# EAGLE design General IO (EAGLE 4.13)
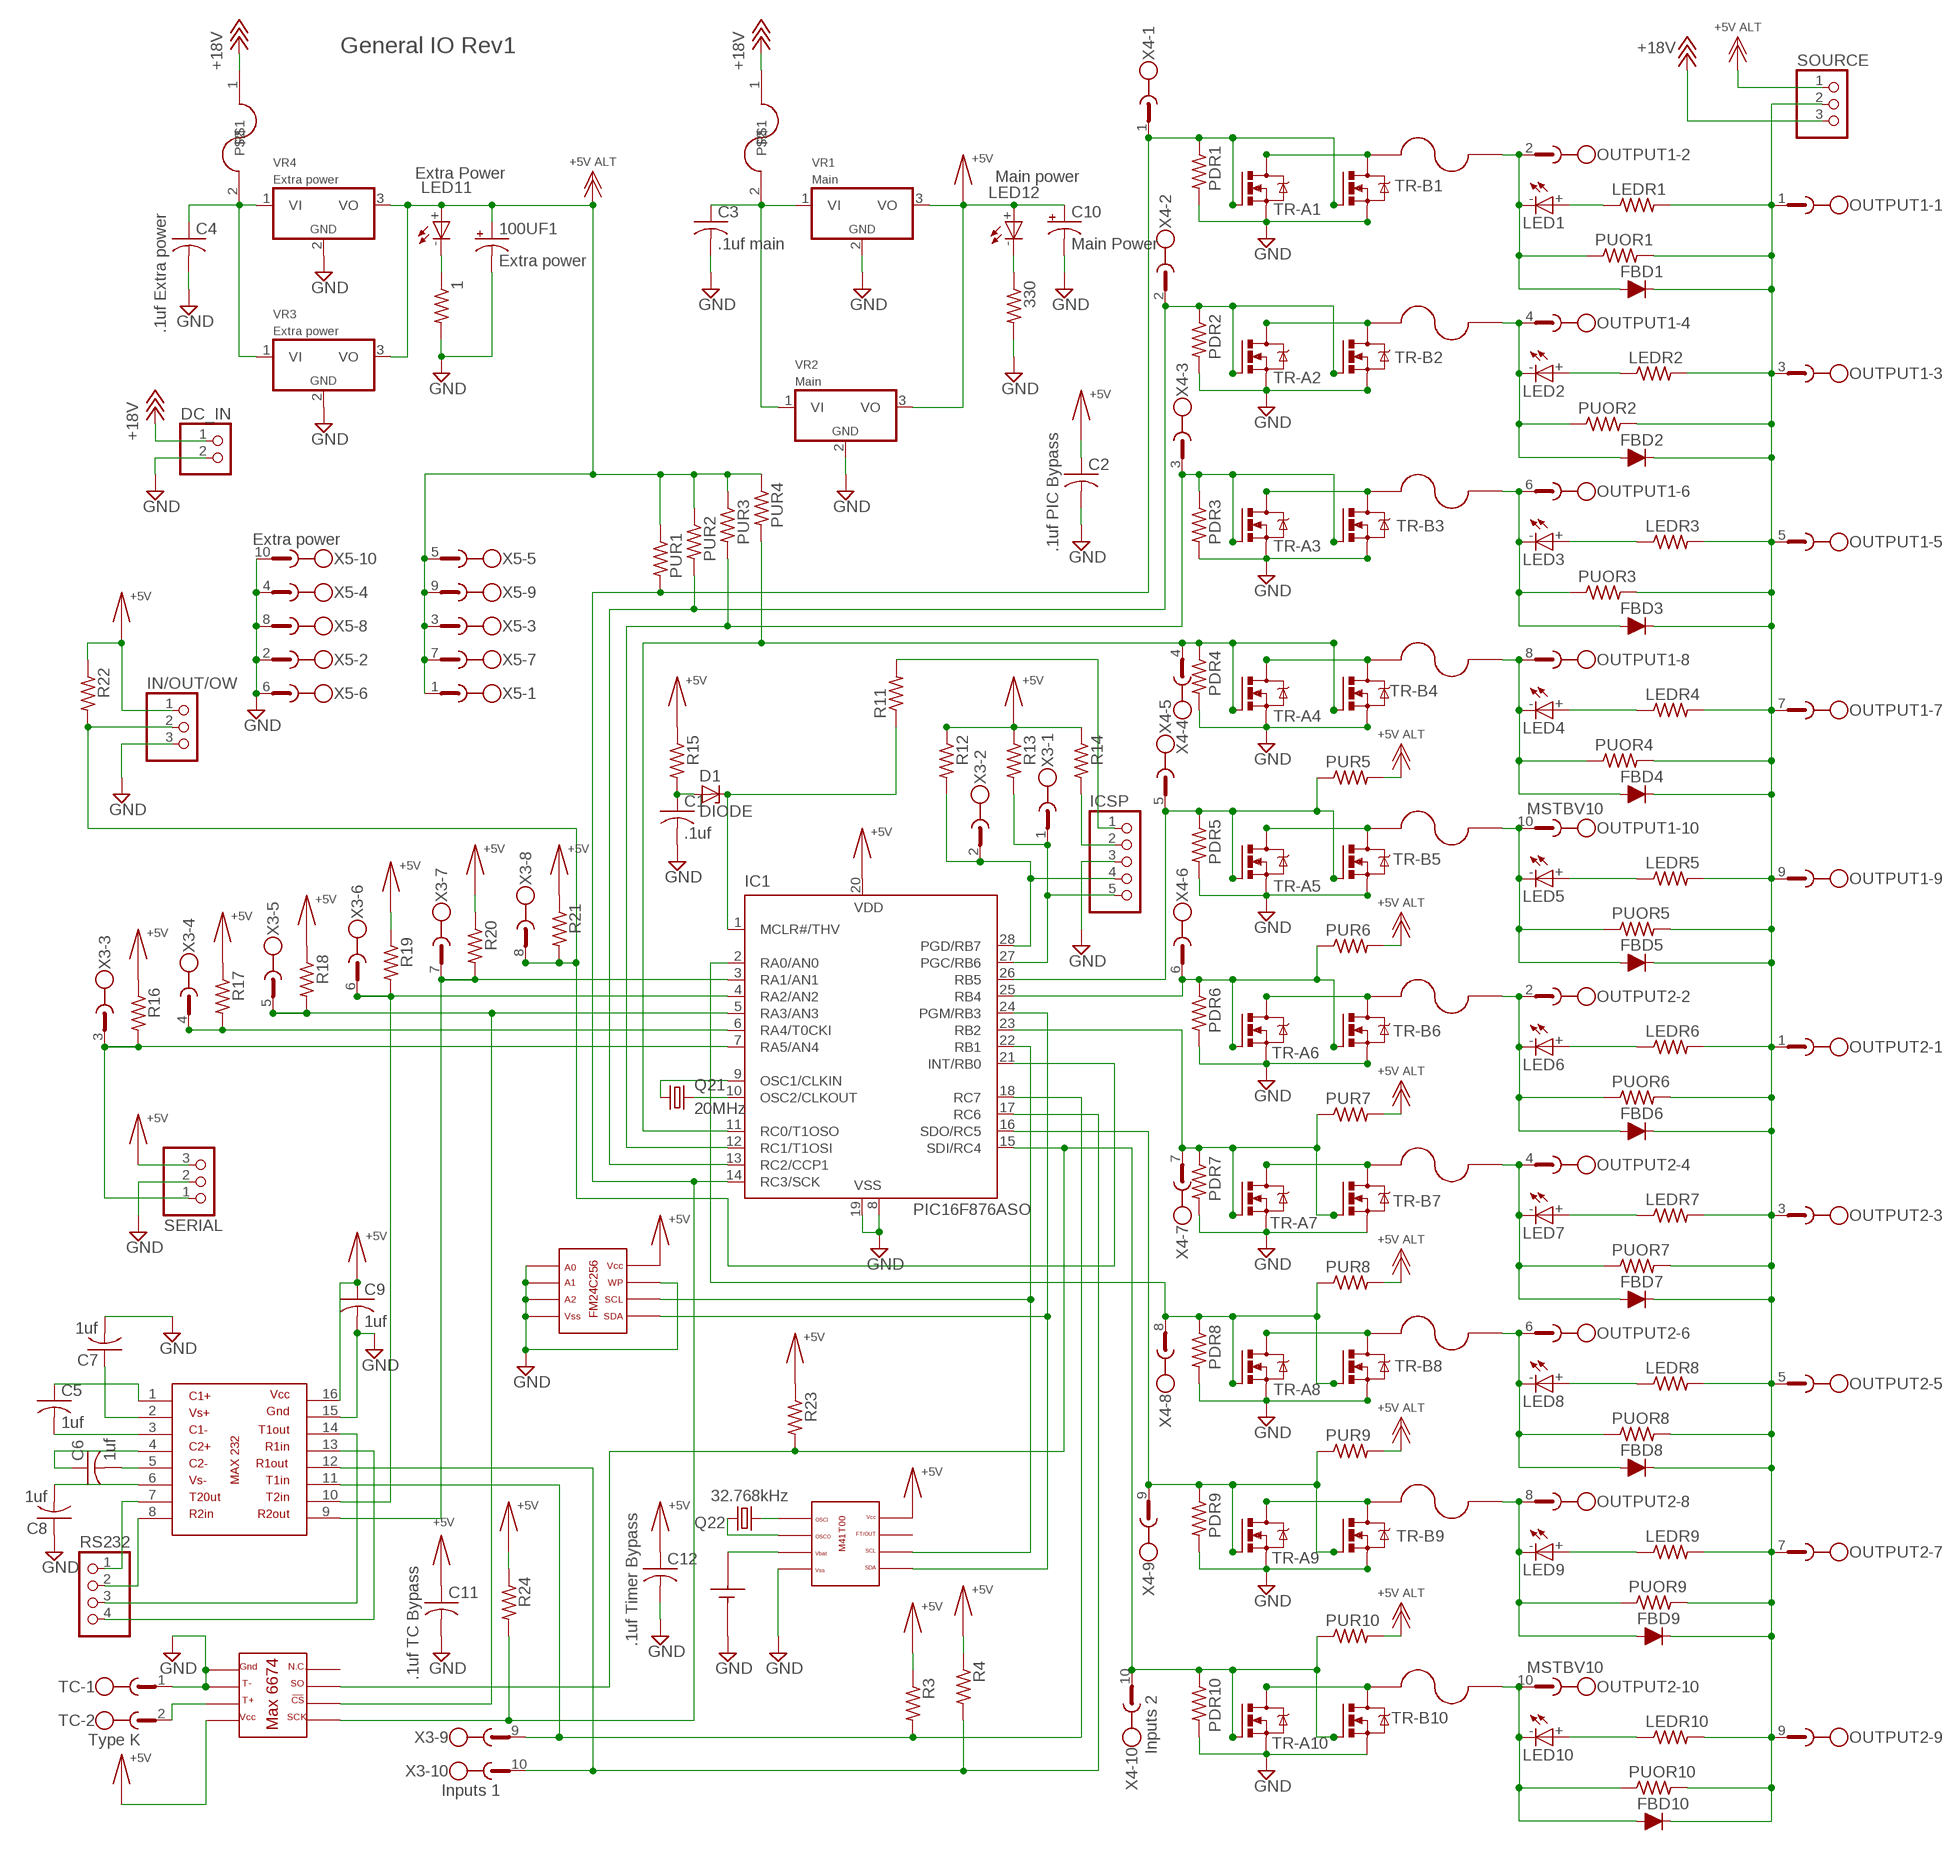
[diagram p0: schematic, sheet 1]

## Parts
1  RESISITORR1210  [R1210]
100UF1  Extra power  CAPACITOR-ELECTROLYTICG  [PANASONIC_G]
330  RESISITORR1210  [R1210]
BAT1  BH-401  [BH-401]
C1  .1uf  CAPACITOR-NO-POLARITYC1210  [C1210]
C2  .1uf PIC Bypass  CAPACITOR-NO-POLARITYC1210  [C1210]
C3  .1uf main  CAPACITOR-NO-POLARITYC1210  [C1210]
C4  .1uf Extra power  CAPACITOR-NO-POLARITYC1210  [C1210]
C5  1uf  CAPACITOR-NO-POLARITYC1210  [C1210]
C6  1uf  CAPACITOR-NO-POLARITYC1210  [C1210]
C7  1uf  CAPACITOR-NO-POLARITYC1210  [C1210]
C8  1uf  CAPACITOR-NO-POLARITYC1210  [C1210]
C9  1uf  CAPACITOR-NO-POLARITYC1210  [C1210]
C10  Main Power  CAPACITOR-ELECTROLYTICG  [PANASONIC_G]
C11  .1uf TC Bypass  CAPACITOR-NO-POLARITYC1210  [C1210]
C12  .1uf Timer Bypass  CAPACITOR-NO-POLARITYC1210  [C1210]
D1  DIODE  DIODE-SWITCHING  [SOT323-W]
DC_IN  PINHD-1X2  [1X02]
FBD1  D-FILL-SOD-87  [SOD87]
FBD2  D-FILL-SOD-87  [SOD87]
FBD3  D-FILL-SOD-87  [SOD87]
FBD4  D-FILL-SOD-87  [SOD87]
FBD5  D-FILL-SOD-87  [SOD87]
FBD6  D-FILL-SOD-87  [SOD87]
FBD7  D-FILL-SOD-87  [SOD87]
FBD8  D-FILL-SOD-87  [SOD87]
FBD9  D-FILL-SOD-87  [SOD87]
FBD10  D-FILL-SOD-87  [SOD87]
FUSE1  FUSE(SM)  [FUSE]
FUSE2  FUSE(SM)  [FUSE]
FUSE3  FUSE(SM)  [FUSE]
FUSE4  FUSE(SM)  [FUSE]
FUSE5  FUSE(SM)  [FUSE]
FUSE6  FUSE(SM)  [FUSE]
FUSE7  FUSE(SM)  [FUSE]
FUSE8  FUSE(SM)  [FUSE]
FUSE9  FUSE(SM)  [FUSE]
FUSE10  FUSE(SM)  [FUSE]
IC1  PIC16F876ASO  PIC16F876SO  [SO-28W]
ICSP  PINHD-1X5  [1X05]
IN/OUT/OW  PINHD-1X3  [1X03]
LED1  LED  [1206]
LED2  LED  [1206]
LED3  LED  [1206]
LED4  LED  [1206]
LED5  LED  [1206]
LED6  LED  [1206]
LED7  LED  [1206]
LED8  LED  [1206]
LED9  LED  [1206]
LED10  LED  [1206]
LED11  Extra Power  LED  [1206]
LED12  Main power  LED  [1206]
LEDR1  RESISITORM1406  [M1406]
LEDR2  RESISITORM1406  [M1406]
LEDR3  RESISITORM1406  [M1406]
LEDR4  RESISITORM1406  [M1406]
LEDR5  RESISITORM1406  [M1406]
LEDR6  RESISITORM1406  [M1406]
LEDR7  RESISITORM1406  [M1406]
LEDR8  RESISITORM1406  [M1406]
LEDR9  RESISITORM1406  [M1406]
LEDR10  RESISITORM1406  [M1406]
OUTPUT1  MSTBV10  [MSTBV10]
OUTPUT2  MSTBV10  [MSTBV10]
PDR1  RESISITORM1406  [M1406]
PDR2  RESISITORM1406  [M1406]
PDR3  RESISITORM1406  [M1406]
PDR4  RESISITORM1406  [M1406]
PDR5  RESISITORM1406  [M1406]
PDR6  RESISITORM1406  [M1406]
PDR7  RESISITORM1406  [M1406]
PDR8  RESISITORM1406  [M1406]
PDR9  RESISITORM1406  [M1406]
PDR10  RESISITORM1406  [M1406]
POLYFUSE1  Extra Power  POLYFUSE  [0204/5]
POLYFUSE2  Main power  POLYFUSE  [0204/5]
PUOR1  RESISITORM1406  [M1406]
PUOR2  RESISITORM1406  [M1406]
PUOR3  RESISITORM1406  [M1406]
PUOR4  RESISITORM1406  [M1406]
PUOR5  RESISITORM1406  [M1406]
PUOR6  RESISITORM1406  [M1406]
PUOR7  RESISITORM1406  [M1406]
PUOR8  RESISITORM1406  [M1406]
PUOR9  RESISITORM1406  [M1406]
PUOR10  RESISITORM1406  [M1406]
PUR1  RESISITORM1406  [M1406]
PUR2  RESISITORM1406  [M1406]
PUR3  RESISITORM1406  [M1406]
PUR4  RESISITORM1406  [M1406]
PUR5  RESISITORM1406  [M1406]
PUR6  RESISITORM1406  [M1406]
PUR7  RESISITORM1406  [M1406]
PUR8  RESISITORM1406  [M1406]
PUR9  RESISITORM1406  [M1406]
PUR10  RESISITORM1406  [M1406]
Q21  20MHz  CRYSTALSM49  [SM49]
Q22  32.768kHz  CRYSTALTC26H  [TC26H]
R3  RESISITORM1406  [M1406]
R4  RESISITORM1406  [M1406]
R11  RESISITORR1210  [R1210]
R12  RESISITORM1406  [M1406]
R13  RESISITORM1406  [M1406]
R14  RESISITORM1406  [M1406]
R15  RESISITORR1210  [R1210]
R16  RESISITORM1406  [M1406]
R17  RESISITORM1406  [M1406]
R18  RESISITORM1406  [M1406]
R19  RESISITORM1406  [M1406]
R20  RESISITORM1406  [M1406]
R21  RESISITORM1406  [M1406]
R22  RESISITORR1210  [R1210]
R23  RESISITORM1406  [M1406]
R24  RESISITORM1406  [M1406]
RS232  PINHD-1X4  [1X04]
SERIAL  PINHD-1X3  [1X03]
SOURCE  PINHD-1X3  [1X03]
TC  Type K  MST2V  [MSTBV2]
TR-A1  ZXMN10A08GSOT223  [SOT223R_INFINEON]
TR-A2  ZXMN10A08GSOT223  [SOT223R_INFINEON]
TR-A3  ZXMN10A08GSOT223  [SOT223R_INFINEON]
TR-A4  ZXMN10A08GSOT223  [SOT223R_INFINEON]
TR-A5  ZXMN10A08GSOT223  [SOT223R_INFINEON]
TR-A6  ZXMN10A08GSOT223  [SOT223R_INFINEON]
TR-A7  ZXMN10A08GSOT223  [SOT223R_INFINEON]
TR-A8  ZXMN10A08GSOT223  [SOT223R_INFINEON]
TR-A9  ZXMN10A08GSOT223  [SOT223R_INFINEON]
TR-A10  ZXMN10A08GSOT223  [SOT223R_INFINEON]
TR-B1  ZXMN10A08G  [TO220BV]
TR-B2  ZXMN10A08G  [TO220BV]
TR-B3  ZXMN10A08G  [TO220BV]
TR-B4  ZXMN10A08G  [TO220BV]
TR-B5  ZXMN10A08G  [TO220BV]
TR-B6  ZXMN10A08G  [TO220BV]
TR-B7  ZXMN10A08G  [TO220BV]
TR-B8  ZXMN10A08G  [TO220BV]
TR-B9  ZXMN10A08G  [TO220BV]
TR-B10  ZXMN10A08G  [TO220BV]
U$1  MAX232  [SO16]
U$2  MAX6674  [SO08]
U$4  M41T00TIMER-I2C  [SO08]
U$18  FM24C256  [SO08]
VR1  Main  VOLTAGE-REGULATOR  [TO220S]
VR2  Main  VOLTAGE-REGULATORSO-223  [SOT223R_INFINEON]
VR3  Extra power  VOLTAGE-REGULATORSO-223  [SOT223R_INFINEON]
VR4  Extra power  VOLTAGE-REGULATOR  [TO220S]
X3  Inputs 1  MSTBV10  [MSTBV10]
X4  Inputs 2  MSTBV10  [MSTBV10]
X5  Extra power  MSTBV10  [MSTBV10]

## Nets
$N199: IC1.15(SDI/RC4) PDR10.1 PUR10.1 R23.2 TR-A10.1(G) TR-B10.G U$2.7 X4.10
+5V: C2.1 C9.1 C10.+ C11.1 C12.1 IC1.20(VDD) IN/OUT/OW.1 LED12.+ R3.1 R4.1 R12.1 R13.1 R14.1 R15.1 R16.1 R17.1 R18.1 R19.1 R20.1 R21.1 R22.1 R23.1 R24.1 SERIAL.3 U$1.16 U$2.4 U$4.8(VCC) U$18.8(VDD) VR1.3(VO) VR2.3(VO)
+18V: DC_IN.1 POLYFUSE1.1 POLYFUSE2.1 SOURCE.3
ALT5V: 100UF1.+ LED11.+ PUR1.1 PUR2.1 PUR3.1 PUR4.1 PUR5.2 PUR6.2 PUR7.2 PUR8.2 PUR9.2 PUR10.2 SOURCE.1 VR3.3(VO) VR4.3(VO) X5.1 X5.3 X5.5 X5.7 X5.9
GND: 1.2 100UF1.- 330.2 BAT1.P$2 C1.2 C2.2 C3.2 C4.2 C7.2 C8.1 C9.2 C10.- C11.2 C12.2 DC_IN.2 IC1.8(VSS) IC1.19(VSS) ICSP.3 IN/OUT/OW.3 PDR1.2 PDR2.2 PDR3.2 PDR4.2 PDR5.2 PDR6.2 PDR7.2 PDR8.2 PDR9.2 PDR10.2 SERIAL.2 TC.1 TR-A1.3(S) TR-A2.3(S) TR-A3.3(S) TR-A4.3(S) TR-A5.3(S) TR-A6.3(S) TR-A7.3(S) TR-A8.3(S) TR-A9.3(S) TR-A10.3(S) TR-B1.S TR-B2.S TR-B3.S TR-B4.S TR-B5.S TR-B6.S TR-B7.S TR-B8.S TR-B9.S TR-B10.S U$1.15 U$2.1 U$2.2 U$4.4(VSS) U$18.1(A0) U$18.2(A1) U$18.3(A2) U$18.4(VSS) U$18.7(WP) VR1.2(GND) VR2.2(GND) VR3.2(GND) VR4.2(GND) X5.2 X5.4 X5.6 X5.8 X5.10
N$1: FUSE7.P$1 TR-A7.2(D) TR-B7.D
N$2: FUSE9.P$1 TR-A9.2(D) TR-B9.D
N$3: IC1.25(RB4) PDR6.1 PUR6.1 TR-A6.1(G) TR-B6.G X4.6
N$4: FBD6.2(A) FUSE6.P$2 LED6.- OUTPUT2.2 PUOR6.1
N$5: FBD7.2(A) FUSE7.P$2 LED7.- OUTPUT2.4 PUOR7.1
N$6: FUSE6.P$1 TR-A6.2(D) TR-B6.D
N$7: FUSE8.P$1 TR-A8.2(D) TR-B8.D
N$8: IC1.23(RB2) PDR7.1 PUR7.1 TR-A7.1(G) TR-B7.G X4.7
N$9: FBD10.2(A) FUSE10.P$2 LED10.- OUTPUT2.10 PUOR10.1
N$10: FBD8.2(A) FUSE8.P$2 LED8.- OUTPUT2.6 PUOR8.1
N$11: IC1.16(SDO/RC5) PDR9.1 PUR9.1 TR-A9.1(G) TR-B9.G X4.9
N$12: IC1.2(RA0/AN0) PDR8.1 PUR8.1 TR-A8.1(G) TR-B8.G X4.8
N$13: FBD9.2(A) FUSE9.P$2 LED9.- OUTPUT2.8 PUOR9.1
N$14: FUSE10.P$1 TR-A10.2(D) TR-B10.D
N$15: IC1.21(INT/RB0) IN/OUT/OW.2 R21.2 R22.2 X3.8
N$16: FBD2.2(A) FUSE2.P$2 LED2.- OUTPUT1.4 PUOR2.1
N$17: FUSE5.P$1 TR-A5.2(D) TR-B5.D
N$18: FBD5.2(A) FUSE5.P$2 LED5.- OUTPUT1.10 PUOR5.1
N$19: RS232.1 U$1.7
N$20: IC1.26(RB5) PDR5.1 PUR5.1 TR-A5.1(G) TR-B5.G X4.5
N$21: FUSE4.P$1 TR-A4.2(D) TR-B4.D
N$22: FBD4.2(A) FUSE4.P$2 LED4.- OUTPUT1.8 PUOR4.1
N$23: FUSE3.P$1 TR-A3.2(D) TR-B3.D
N$24: FBD3.2(A) FUSE3.P$2 LED3.- OUTPUT1.6 PUOR3.1
N$25: IC1.12(RC1/T1OSI) PDR3.1 PUR3.2 TR-A3.1(G) TR-B3.G X4.3
N$26: IC1.14(RC3/SCK) PDR1.1 PUR1.2 R24.2 TR-A1.1(G) TR-B1.G U$2.5 X4.1
N$27: FUSE2.P$1 TR-A2.2(D) TR-B2.D
N$28: IC1.13(RC2/CCP1) PDR2.1 PUR2.2 TR-A2.1(G) TR-B2.G X4.2
N$29: FUSE1.P$1 TR-A1.2(D) TR-B1.D
N$30: FBD1.2(A) FUSE1.P$2 LED1.- OUTPUT1.2 PUOR1.1
N$31: IC1.28(PGD/RB7) ICSP.4 R12.2 X3.2
N$32: IC1.11(RC0/T1OSO) PDR4.1 PUR4.2 TR-A4.1(G) TR-B4.G X4.4
N$33: IC1.7(RA5/AN4) R16.2 SERIAL.1 X3.3
N$34: ICSP.1 R11.2
N$35: IC1.10(OSC2/CLKOUT) Q21.2
N$36: C1.1 D1.1(A) R15.2
N$37: D1.3(C) IC1.1(MCLR#/THV) R11.1
N$38: ICSP.2 R14.2
N$39: IC1.9(OSC1/CLKIN) Q21.1
N$40: IC1.27(PGC/RB6) ICSP.5 R13.2 X3.1
N$41: IC1.6(RA4/T0CKI) R17.2 X3.4
N$42: IC1.22(RB1) U$4.6(SCL) U$18.6(SCL)
N$43: IC1.4(RA2/AN2) R19.2 U$1.10 X3.6
N$44: IC1.3(RA1/AN1) R20.2 U$1.9 X3.7
N$45: RS232.2 U$1.8
N$46: TC.2 U$2.3
N$47: IC1.17(RC6) R4.2 U$1.12 X3.10
N$49: RS232.3 U$1.14
N$52: FBD1.1(C) FBD2.1(C) FBD3.1(C) FBD4.1(C) FBD5.1(C) FBD6.1(C) FBD7.1(C) FBD8.1(C) FBD9.1(C) FBD10.1(C) LEDR1.2 LEDR2.2 LEDR3.2 LEDR4.2 LEDR5.2 LEDR6.2 LEDR7.2 LEDR8.2 LEDR9.2 LEDR10.2 OUTPUT1.1 OUTPUT1.3 OUTPUT1.5 OUTPUT1.7 OUTPUT1.9 OUTPUT2.1 OUTPUT2.3 OUTPUT2.5 OUTPUT2.7 OUTPUT2.9 PUOR1.2 PUOR2.2 PUOR3.2 PUOR4.2 PUOR5.2 PUOR6.2 PUOR7.2 PUOR8.2 PUOR9.2 PUOR10.2 SOURCE.2
N$53: Q22.1 U$4.2(OSCO)
N$54: Q22.2 U$4.1(OSCI)
N$55: 330.1 LED12.-
N$56: BAT1.P$1 U$4.3(VBAT)
N$60: RS232.4 U$1.13
N$62: C4.1 POLYFUSE1.2 VR3.1(VI) VR4.1(VI)
N$63: C3.1 POLYFUSE2.2 VR1.1(VI) VR2.1(VI)
N$64: LED10.+ LEDR10.1
N$65: LED9.+ LEDR9.1
N$66: 1.1 LED11.-
N$67: LED8.+ LEDR8.1
N$68: IC1.24(PGM/RB3) U$4.5(SDA) U$18.5(SDA)
N$69: LED7.+ LEDR7.1
N$70: LED6.+ LEDR6.1
N$71: LED5.+ LEDR5.1
N$72: LED4.+ LEDR4.1
N$73: LED3.+ LEDR3.1
N$74: LED2.+ LEDR2.1
N$75: LED1.+ LEDR1.1
N$80: C6.2 U$1.5
N$81: C5.2 U$1.3
N$82: C6.1 U$1.4
N$83: C5.1 U$1.1
N$84: C7.1 U$1.2
N$85: C8.2 U$1.6
N$86: IC1.18(RC7) R3.2 U$1.11 X3.9
N$94: IC1.5(RA3/AN3) R18.2 U$2.6 X3.5
Unconnected: U$2.8 U$4.7(FT/OUT)

## Notes on the sheet
- General IO Rev1

## Library data of the parts
1 330 LEDR1-LEDR10 PDR1-PDR10 PUOR1-PUOR10 PUR1-PUR10 R3 R4 R11-R24 = 1 Dan's Common Parts:RESISITOR: RESISTOR, American symbol
100UF1 C10 = 1 Dan's Common Parts:CAPACITOR-ELECTROLYTIC: POLARIZED CAPACITOR, American symbol
BAT1 = 1 Dan's Common Parts:BH-401
C1-C9 C11 C12 = 1 Dan's Common Parts:CAPACITOR-NO-POLARITY: CAPACITOR, American symbol
D1 = 1 Dan's Common Parts:DIODE-SWITCHING: Z DIODE
DC_IN = pinhead:PINHD-1X2: PIN HEADER
FBD1-FBD10 = semicon-smd-ipc:D-FILL-: DIODE filled
FUSE1-FUSE10 = 1 Dan's Common Parts:FUSE(SM)
IC1 = 1 Dan's Common Parts:PIC16*876: MICROCONTROLLER flash type
ICSP = pinhead:PINHD-1X5: PIN HEADER
IN/OUT/OW SERIAL SOURCE = pinhead:PINHD-1X3: PIN HEADER
LED1-LED12 = 1 Dan's Common Parts:LED
OUTPUT1 OUTPUT2 X3-X5 = con-phoenix-508:MSTBV10: PHOENIX
POLYFUSE1 POLYFUSE2 = 1 Dan's Common Parts:POLYFUSE
Q21 Q22 = 1 Dan's Common Parts:CRYSTAL: CRYSTAL
RS232 = pinhead:PINHD-1X4: PIN HEADER
TC = con-phoenix-508:MST2V: PHOENIX
TR-A1-TR-A10 TR-B1-TR-B10 = 1 Dan's Common Parts:ZXMN10A08G: N-CHANNEL MOS FET
U$1 = 1 Dan's Common Parts:MAX232
U$2 = 1 Dan's Common Parts:MAX6674
U$4 = 1 Dan's Common Parts:M41T00TIMER-I2C
U$18 = 1 Dan's Common Parts:FM24C256
VR1-VR4 = 1 Dan's Common Parts:VOLTAGE-REGULATOR: Positive VOLTAGE REGULATOR Source: http://cache.national.com/ds/LM/LM78L05.pdf http://www.fairchildsemi.com/ds/LM/LM7805.pdf

## Board
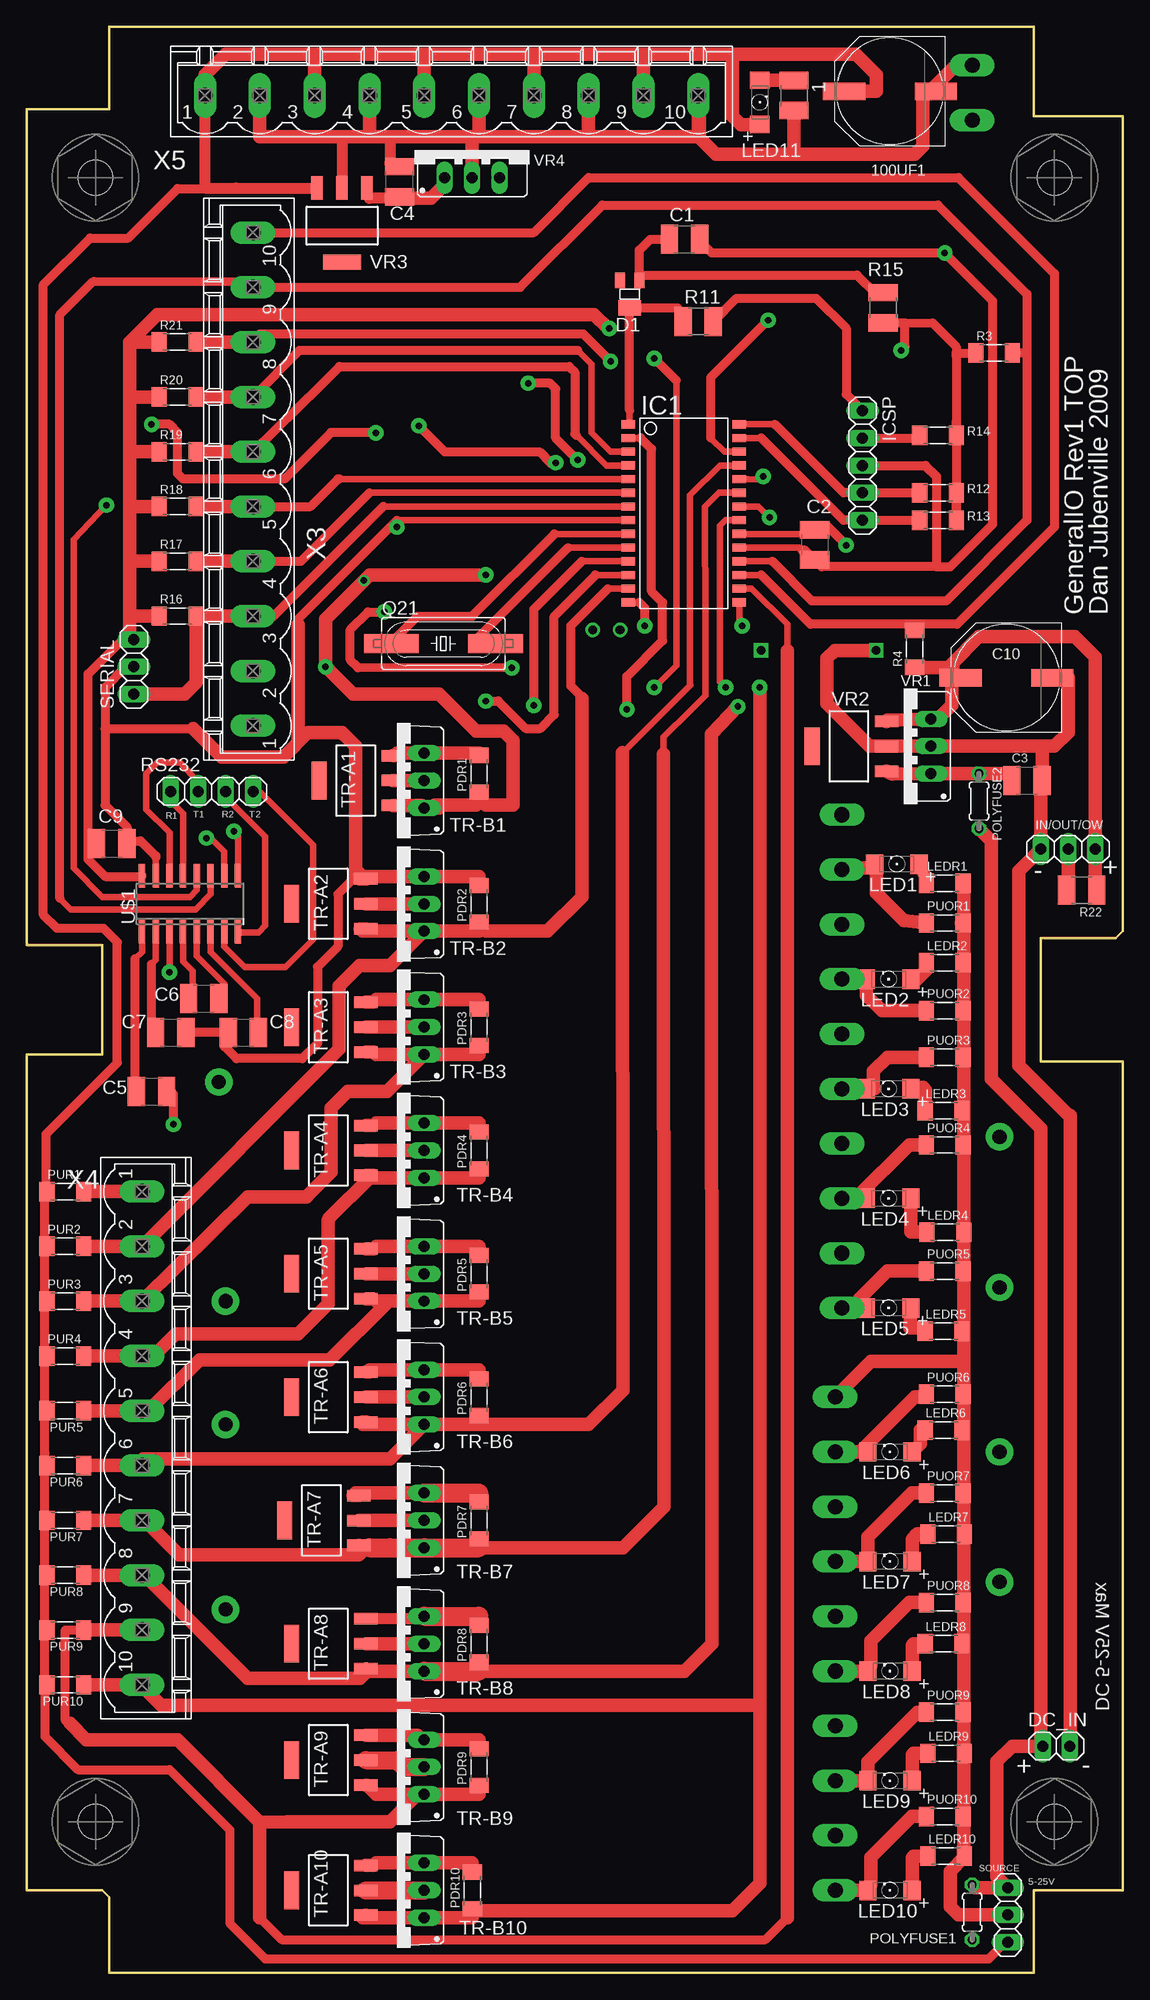
[diagram p1: board, top side]
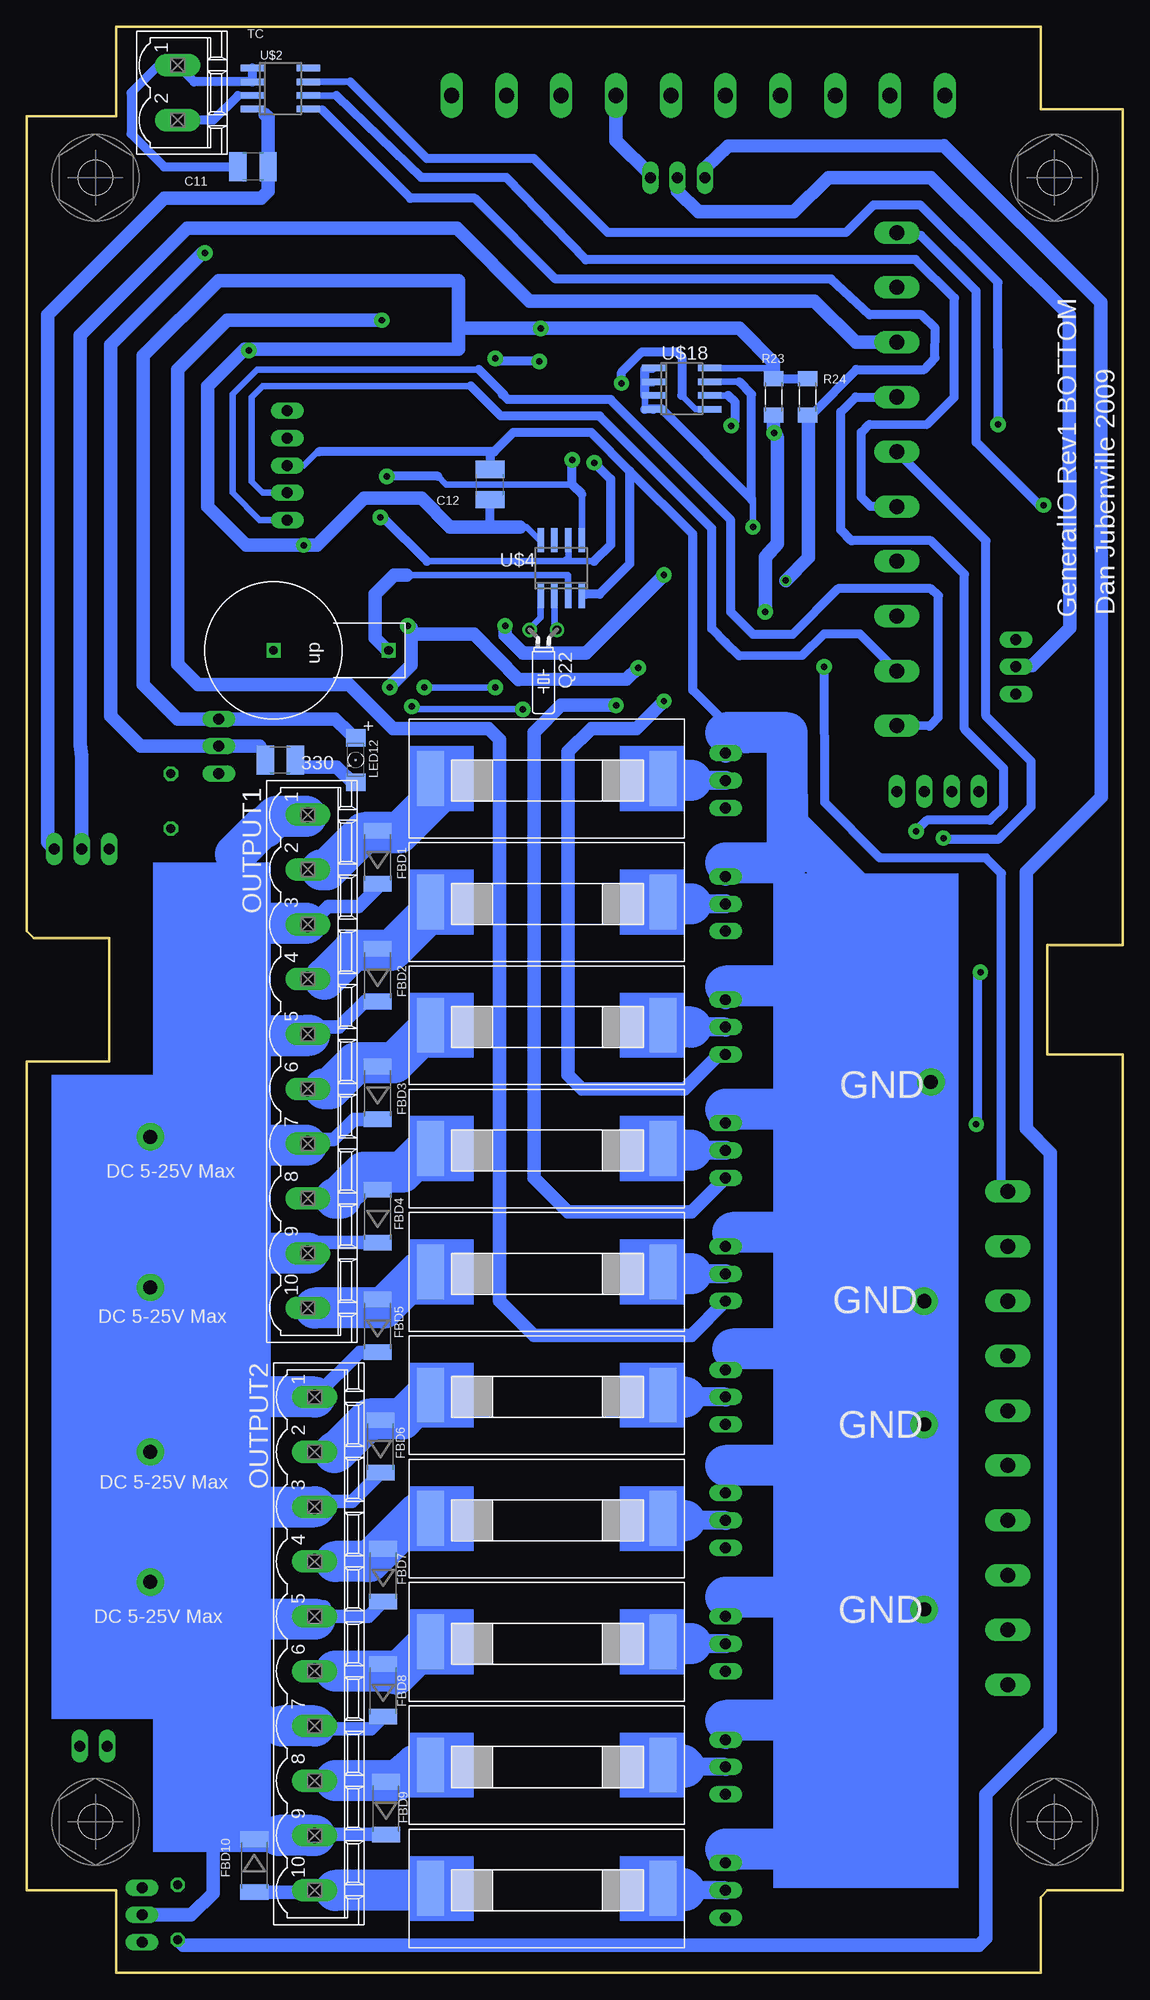
[diagram p2: board, bottom side, seen from below]

Size 101.6 x 180.34 mm. Coordinates in mm from the lower left corner, seen from the top.
Outline: 93.34,0 7.62,0 7.62,6.98 6.99,7.62 0,7.62 0,85.09 6.99,85.09 6.99,95.25 0,95.25 0,172.72 7.62,172.72 7.62,180.34 93.34,180.34 93.34,172.09 101.6,172.09 101.6,96.52 100.97,95.88 93.98,95.88 93.98,84.45 101.6,84.45 101.6,7.62 93.34,7.62 93.34,0
Copper layers (1*16): Top 0.035mm / dielectric 1.5mm / Bottom 0.035mm
Design rules "default": minimum track width 15mil, minimum drill 20mil, track to track 15mil, track to pad 15mil, pad to pad 15mil, via to via 15mil, smd to smd 0mil, copper to edge 15mil, drill to drill 15mil, minimum pad ring 10mil, minimum via ring 8mil, stop-mask expansion 4mil, vias tented up to drill 0mil, thermal gap 10mil

### Footprints (pad centres in the part's own frame; a part is rotated, then mirrored left to right if it is on the bottom)
R1210 = smd 1.6 x 2.7: 1 -1.4,0; 2 1.4,0
PANASONIC_G = smd 3.9 x 1.6: + 4.25,0; - -4.25,0
BH-401 = drill 0.8 square: P$1 0,0; P$2 0,10.668
C1210 = smd 1.6 x 2.7: 1 -1.4,0; 2 1.4,0
SOT323-W = smd 0.9 x 1.45: 1 -0.9,-1.275; 2 0.9,-1.275 | smd 2.1 x 1.45: 3 0,1.275
1X02 = drill 1.016 long: 1 -1.27,0; 2 1.27,0
SOD87 = smd 1.45 x 2.6: 1 -2.445,0; 2 2.445,0
FUSE = smd 2.54 x 5.08: P$1 2,5.54; P$2 23.54,5.54
SO-28W = smd 0.762 x 1.27: 1 -7.62,-5.207; 2 -6.35,-5.207; 3 -5.08,-5.207; 4 -3.81,-5.207; 5 -2.54,-5.207; 6 -1.27,-5.207; 7 0,-5.207; 8 1.27,-5.207; 9 2.54,-5.207; 10 3.81,-5.207; 11 5.08,-5.207; 12 6.35,-5.207; 13 7.62,-5.207; 14 8.89,-5.207; 15 8.89,5.08; 16 7.62,5.08; 17 6.35,5.08; 18 5.08,5.08; 19 3.81,5.08; 20 2.54,5.08; 21 1.27,5.08; 22 0,5.08; 23 -1.27,5.08; 24 -2.54,5.08; 25 -3.81,5.08; 26 -5.08,5.08; 27 -6.35,5.08; 28 -7.62,5.08
1X05 = drill 1.016 long: 1 -5.08,0; 2 -2.54,0; 3 0,0; 4 2.54,0; 5 5.08,0
1X03 = drill 1.016 long: 1 -2.54,0; 2 0,0; 3 2.54,0
1206 = smd 1.6 x 1.803: + -1.422,0; - 2.692,0
M1406 = smd 1.4 x 1.8: 1 -1.7,0; 2 1.7,0
MSTBV10 = drill 1.397 long: 1 -22.86,0; 2 -17.78,0; 3 -12.7,0; 4 -7.62,0; 5 -2.54,0; 6 2.54,0; 7 7.62,0; 8 12.7,0; 9 17.78,0; 10 22.86,0
0204/5 = drill 0.813 octagon: 1 -2.54,0; 2 2.54,0
SM49 = smd 5.08 x 1.778: 1 -4.826,0; 2 4.826,0
TC26H = drill 0.813 round: 1 -1.27,0; 2 1.27,0
1X04 = drill 1.016 long: 1 -3.81,0; 2 -1.27,0; 3 1.27,0; 4 3.81,0
MSTBV2 = drill 1.397 long: 1 -2.54,0; 2 2.54,0
SOT223R_INFINEON = smd 1.067 x 2.184: 1 -2.311,-3.479; 2 0,-3.48; 3 2.312,-3.48 | smd 3.5 x 1.4: 4 0,3.404
TO220BV = drill 1.016 long: D 0,-2.54; G -2.54,-2.54; S 2.54,-2.54
SO16 = smd 0.6 x 2.2: 1 -4.445,-2.6; 2 -3.175,-2.6; 3 -1.905,-2.6; 4 -0.635,-2.6; 5 0.635,-2.6; 6 1.905,-2.6; 7 3.175,-2.6; 8 4.445,-2.6; 9 4.445,2.6; 10 3.175,2.6; 11 1.905,2.6; 12 0.635,2.6; 13 -0.635,2.6; 14 -1.905,2.6; 15 -3.175,2.6; 16 -4.445,2.6
SO08 = smd 0.6 x 2.2: 1 -1.905,-2.6; 2 -0.635,-2.6; 3 0.635,-2.6; 4 1.905,-2.6; 5 1.905,2.6; 6 0.635,2.6; 7 -0.635,2.6; 8 -1.905,2.6
SCREW = hole 3.2: 0,0
TO220S = drill 1.016 long: 1 -2.54,-2.54; 2 0,-2.54; 3 2.54,-2.54

### Placement (x,y rotation side)
1  71.12,173.99 270 top
100UF1  80.01,174.37 180 top
330  78.11,112.39 180 bottom
BAT1  68.07,122.55 90 bottom
C1  60.96,160.66 0 top
C2  73.03,132.33 270 top
C3  92.71,110.49 0 top
C4  34.54,165.99 90 top
C5  11.56,81.66 0 top
C6  16.38,90.3 0 top
C7  13.34,87.12 0 top
C8  20.07,87.12 0 top
C9  7.87,104.65 0 top
C10  90.81,120.02 180 top
C11  80.64,167.39 180 bottom
C12  58.67,137.92 90 bottom
D1  55.88,155.58 180 top
DC_IN  95.43,20.98 0 top
FBD1  69.09,103.38 90 bottom
FBD2  69.09,92.46 90 bottom
FBD3  69.09,81.53 90 bottom
FBD4  69.09,70.1 90 bottom
FBD5  69.09,59.94 90 bottom
FBD6  68.83,48.77 90 bottom
FBD7  68.58,36.83 90 bottom
FBD8  68.58,26.16 90 bottom
FBD9  68.33,15.24 90 bottom
FBD10  80.52,9.91 270 bottom
FUSE1  40.64,116.2 180 bottom
FUSE2  40.64,104.77 180 bottom
FUSE3  40.64,93.34 180 bottom
FUSE4  40.64,81.91 180 bottom
FUSE5  40.64,70.48 180 bottom
FUSE6  40.64,59.05 180 bottom
FUSE7  40.64,47.62 180 bottom
FUSE8  40.64,36.2 180 bottom
FUSE9  40.64,24.77 180 bottom
FUSE10  40.64,13.33 180 bottom
IC1  60.96,135.89 270 top
ICSP  77.47,139.7 270 top
IN/OUT/OW  96.52,104.14 180 top
LED1  81.28,102.74 180 top
LED2  80.52,92.08 180 top
LED3  80.52,81.91 180 top
LED4  80.52,71.75 180 top
LED5  80.52,61.6 180 top
LED6  80.64,48.26 180 top
LED7  80.64,38.1 180 top
LED8  80.64,27.94 180 top
LED9  80.64,17.78 180 top
LED10  80.64,7.62 180 top
LED11  67.94,172.72 90 top
LED12  71.12,113.03 270 bottom
LEDR1  85.09,100.96 0 top
LEDR2  85.09,93.6 0 top
LEDR3  84.96,79.88 0 top
LEDR4  85.14,68.61 0 top
LEDR5  84.96,59.44 0 top
LEDR6  84.96,50.29 0 top
LEDR7  85.22,40.64 0 top
LEDR8  84.96,30.48 0 top
LEDR9  85.22,20.32 0 top
LEDR10  85.22,10.79 0 top
OUTPUT1  75.56,84.45 270 bottom
OUTPUT2  74.93,30.48 270 bottom
PDR1  41.91,111.12 90 top
PDR2  41.91,99.06 90 top
PDR3  41.91,87.63 90 top
PDR4  41.91,76.2 90 top
PDR5  41.91,64.77 90 top
PDR6  41.91,53.34 90 top
PDR7  41.91,41.91 90 top
PDR8  41.91,30.48 90 top
PDR9  41.91,19.05 90 top
PDR10  41.27,7.62 90 top
POLYFUSE1  87.63,5.59 270 top
POLYFUSE2  88.27,108.58 90 top
PUOR1  85.09,97.28 0 top
PUOR2  85.09,89.15 0 top
PUOR3  85.09,84.84 0 top
PUOR4  85.09,76.71 0 top
PUOR5  85.09,65.02 0 top
PUOR6  85.09,53.59 0 top
PUOR7  85.09,44.45 0 top
PUOR8  85.09,34.29 0 top
PUOR9  85.09,24.13 0 top
PUOR10  85.09,14.48 0 top
PUR1  3.56,72.39 0 top
PUR2  3.56,67.31 0 top
PUR3  3.56,62.23 0 top
PUR4  3.56,57.15 0 top
PUR5  3.56,52.07 180 top
PUR6  3.56,46.99 180 top
PUR7  3.56,41.91 180 top
PUR8  3.56,36.83 180 top
PUR9  3.56,31.75 180 top
PUR10  3.56,26.67 180 top
Q21  38.61,123.19 0 top
Q22  53.72,124.46 180 bottom
R3  89.66,150.11 0 top
R4  82.3,122.68 90 top
R11  62.23,153.03 0 top
R12  84.45,137.16 180 top
R13  84.45,134.62 180 top
R14  84.45,142.49 180 top
R15  79.38,154.31 90 top
R16  13.97,125.73 0 top
R17  13.97,130.81 0 top
R18  13.97,135.89 0 top
R19  13.97,140.97 0 top
R20  13.97,146.05 0 top
R21  13.97,151.13 0 top
R22  97.79,100.33 180 top
R23  32.38,146.05 270 bottom
R24  29.21,146.05 270 bottom
RS232  17.14,109.47 180 top
SERIAL  9.91,121.03 90 top
SOURCE  90.93,5.33 90 top
TC  87.63,174.24 270 bottom
TR-A1  30.48,110.49 90 top
TR-A2  27.94,99.06 90 top
TR-A3  27.94,87.63 90 top
TR-A4  27.94,76.2 90 top
TR-A5  27.94,64.77 90 top
TR-A6  27.94,53.34 90 top
TR-A7  27.3,41.91 90 top
TR-A8  27.94,30.48 90 top
TR-A9  27.94,19.68 90 top
TR-A10  27.94,7.62 90 top
TR-B1  34.29,110.49 90 top
TR-B2  34.29,99.06 90 top
TR-B3  34.29,87.63 90 top
TR-B4  34.29,76.2 90 top
TR-B5  34.29,64.77 90 top
TR-B6  34.29,53.34 90 top
TR-B7  34.29,41.91 90 top
TR-B8  34.29,30.48 90 top
TR-B9  34.29,19.05 90 top
TR-B10  34.29,7.62 90 top
U$1  15.11,99.06 0 top
U$2  78.11,174.62 270 bottom
U$4  52.07,130.18 0 bottom
U$11  [SCREW]  6.35,13.97 0 top
U$13  [SCREW]  95.25,13.97 0 top
U$14  [SCREW]  95.25,166.37 0 top
U$15  [SCREW]  6.35,166.37 0 top
U$18  40.89,146.81 270 bottom
VR1  81.28,113.66 90 top
VR2  76.2,113.66 90 top
VR3  29.21,161.93 180 top
VR4  41.27,168.91 0 top
X3  20.95,138.43 90 top
X4  10.67,49.53 270 top
X5  39.37,173.99 0 top

### Tracks (layer width: path | path; a pad name or v marks a point on that pad's centre or on a via)
$N199  (via drill 0.6 pad 1.42)
  Top 0.61: v66.29,124.84 66.04,124.99 IC1.15
  Top 0.813: v11.56,143.51 13.21,143.51 13.97,142.75 13.97,138.94 14.48,138.43 23.88,138.43 28.19,142.75 v32.33,142.72 | v33.15,126.11 31.62,126.11 29.97,124.46 29.97,121.67 30.68,120.95 v44.93,120.93
  Top 1.27: TR-A10.1 31.34,5.31 31.11,5.08 TR-B10.G 41.27,5.08 41.27,5.71 | 67.94,24.77 67.94,8.26 65.41,5.71 41.27,5.71 | 67.94,24.77 v67.94,119.13 | 41.27,5.71 PDR10.1 | 10.54,26.67 12.45,24.77 67.94,24.77 | PUR10.1 10.54,26.67 | 10.54,26.67 X4.10
  Bottom 0.61: 71.63,175.26 U$2.7 | v33.15,126.11 33.15,126.36 | 32.38,143.51 R23.2 | 32.38,143.26 32.26,143.13 32.26,143.51 | 32.26,143.51 32.26,144.27 32.51,144.02 32.51,143.76 32.26,143.51
  Bottom 0.813: 71.63,175.26 64.52,168.15 54.61,168.15 47.75,161.29 25.68,161.29 23.11,163.83 18.8,163.83 11.58,156.67 11.56,144.4 v11.56,143.51
  Bottom 1.27: 66.19,124.87 v66.29,124.84 66.12,124.79 65.99,124.69 65.99,124.08 | 33.15,126.36 33.15,131.19 32,132.46 32,142.27 32.36,142.93 v32.33,142.72 32.38,143.26 32.38,143.51 | v67.94,119.13 68.07,119.13 67.92,119.25 65.99,121.18 65.99,124.08 | 65.99,124.08 60.17,124.08 56.01,119.86 46,119.89 44.96,120.93 v44.93,120.93
+5V  (via drill 0.6 pad 1.42)
  Top 0.61: C2.1 72.52,133.86 72.64,133.35 IC1.20 | SERIAL.3 9.53,123.83 | v75.95,132.31 75.95,132.33
  Top 0.813: 81.41,152.91 R15.1 | 86.16,149.86 R14.1 86.16,143.72 86.16,143.49 R13.1 R12.1 86.13,136.96 | 86.16,149.86 86.16,150.7 83.95,152.91 81.41,152.91 | C2.1 72.64,134.11 72.64,133.35 73.66,134.11 74.17,134.11 75.95,132.33 | 81.41,152.91 81.41,150.75 v81.03,150.37 | 86.16,149.86 86.16,150.11 R3.1 | SERIAL.3 8.89,123.57 5.66,120.37 5.66,104.55 | 5.66,103.48 5.66,104.55 | 5.66,104.55 5.67,104.55 6.4,104.55 6.4,104.22 5.66,103.48 | 5.66,103.48 5.66,103.17 7.24,101.6 10.54,101.6 10.6,101.66 U$1.16
  Top 1.27: 9.53,151.13 R21.1 | 9.53,125.73 9.53,130.81 | 9.53,130.81 9.53,135.89 | 9.53,135.89 9.53,140.97 | 9.53,140.97 9.53,146.05 | 9.53,125.73 R16.1 | 9.53,130.81 R17.1 | 9.53,140.97 R19.1 | 9.53,146.05 R20.1 | 9.53,135.89 R18.1 | 9.53,135.89 9.53,146.05 | 9.53,146.05 9.53,151.13 | 9.53,151.13 12.06,153.67 52.58,153.67 53.85,152.4 v53.98,152.4 | VR2.3 79.78,116.1 VR1.3 84.45,116.2 85.72,117.47 85.72,120.02 | 87,120.02 C10.+ 85.72,120.02 | 9.53,123.83 9.53,125.73 | R22.1 99.06,99.69 IN/OUT/OW.1 99.06,121.92 97.16,123.83 88.27,123.83 85.72,121.28 85.72,121.16 | 85.72,120.02 85.72,121.16 | 85.72,121.16 85.85,121.16 85.85,120.98 R4.1 | 6.4,104.55 C9.1
  Bottom 0.406: 56.52,133.99 58.67,133.99
  Bottom 0.61: 55.88,133.99 55.3,133.99 54.03,132.72 U$4.8 | LED12.+ 71.12,114.3 71.75,114.94 | VR1.3 85.09,116.2 | U$18.8 38.35,148.72 32.44,148.72 R23.1 | R24.1 29.21,147.96 29.41,147.75 R23.1 | R23.1 32.59,147.75 32.38,147.96 R23.1 | 81.41,150.5 v81.03,150.37 | 79.5,172.21 80.01,172.72 U$2.4 80.77,172.72
  Bottom 0.813: R23.1 R24.1 | 58.67,133.99 C12.1
  Bottom 1.27: 61.59,152.4 v53.98,152.4 35.56,152.4 32.38,149.23 32.38,147.96 | 61.59,152.4 61.59,156.84 83.82,156.84 90.81,149.86 90.81,119.38 87.63,116.2 VR1.3 73.03,116.2 71.75,114.94 | 61.59,152.4 61.59,153.03 | 61.59,152.4 61.59,150.5 81.41,150.5 84.84,147.07 84.84,135.89 81.28,132.33 75.95,132.33 v75.95,132.31 74.7,132.31 70.36,136.65 65.02,136.65 62.36,133.99 56.52,133.99 55.88,133.99 | IN/OUT/OW.1 99.69,104.77 99.69,153.67 88.9,164.47 79.88,164.47 79.25,165.1 79.25,167.13 C11.1 79.25,171.96 79.5,172.21
+18V
  Top 1.27: 91.34,20.98 DC_IN.1 | 91.34,20.98 89.92,19.56 89.92,8.89 SOURCE.3 87.88,7.87 POLYFUSE1.1 | 91.34,20.98 93.88,20.98 93.98,21.08 93.98,78.23 89.41,82.8 89.41,104.9 POLYFUSE2.1
ALT5V
  Top 0.254: PUR7.2 1.78,42.42 | 1.65,62.74 1.78,62.74
  Top 0.61: 1.65,27.18 1.68,26.82 PUR10.2 | 1.65,32.26 PUR9.2 | 1.65,37.34 PUR8.2 | 1.65,42.67 PUR7.2 | 1.65,48.13 PUR6.2 | 1.65,52.58 PUR5.2 | 1.65,57.91 PUR4.1 | 1.4,62.87 1.65,62.74 PUR3.1 | 1.65,72.9 PUR1.1 1.78,73.48 | 1.65,67.82 PUR2.1 | 16.48,165.35 16.54,165.41 16.51,168.66 | 90.68,2.79 SOURCE.1
  Top 0.813: 1.65,27.18 1.65,32.26 1.65,37.34 1.65,42.67 1.65,48.13 1.65,52.58 1.65,57.91 1.65,62.74 1.65,67.82 1.65,72.9 | 1.78,73.48 1.78,77.72 8.38,84.33 8.38,95.5 7.11,96.77 2.79,96.77 1.52,98.04 1.52,156.46 5.84,160.78 9.4,160.78 13.97,165.35 16.48,165.35 | 90.68,2.79 89.15,1.27 22.1,1.27 18.8,4.57 18.8,13.21 13.21,18.8 4.72,18.8 1.68,21.87 1.68,26.82
  Top 1.016: VR3.3 19.38,165.41 16.54,165.41 16.51,165.41 16.51,168.66 X5.1
  Top 1.27: X5.1 16.51,175.9 18.41,177.8 26.67,177.8 | 26.67,177.8 36.83,177.8 | 36.83,177.8 46.99,177.8 | 46.99,177.8 57.15,177.8 | 26.67,177.8 X5.3 | 36.83,177.8 X5.5 | 46.99,177.8 X5.7 | 57.15,177.8 X5.9 | 57.15,177.8 65.41,177.8 | 65.41,177.8 76.83,177.8 78.74,175.9 78.74,174.37 100UF1.+ | LED11.+ 66.19,171.3 65.41,172.09 65.41,177.8
  Bottom 1.27: VR4.3 43.81,166.62 46.99,169.8 X5.7
GND  (via drill 0.6 pad 1.42, 1.3 pad 2.54)
  Top 0.254: TR-A2.3 30.48,100.96
  Top 0.61: 41.91,44.45 PDR7.2 | 41.91,33.02 PDR8.2 | 25.15,124.94 25.15,125.45 | 25.15,125.45 33.5,133.86 34.29,134.62 | 34.29,134.62 34.92,134.62 | 34.92,134.62 IC1.8 34.29,134.62 | 34.92,134.62 v34.29,133.99 | C7.2 14.73,87.5 15.11,87.12 | 11.94,103.38 U$1.15 | C9.2 9.53,104.77 | 18.41,87 C8.1 | 71.88,131.83 71.76,131.95 C2.2 71.75,131.95 71.63,132.08 IC1.19 | SERIAL.2 9.14,121.03 | 25.15,125.45 25.15,114.81 28.7,114.81 30.48,113.54 | 25.15,125.45 25.15,125.48
  Top 0.813: 62.36,160.53 63.5,159.39 v85.09,159.39 89.53,154.94 89.53,134.24 85.6,130.3 84.33,130.3 | 94.61,113.66 94.11,113.53 | 7.24,115.29 15.39,115.29 | 96.52,120.02 C10.- | C8.1 15.11,87.12 | 7.24,115.29 7.24,108.2 9.27,106.17 9.27,105.03 9.4,104.9 | 9.4,104.9 9.65,104.65 C9.2 9.14,104.65 | 9.4,104.9 10.54,104.9 11.94,103.5 11.94,103.38 | 18.41,87 18.31,85.83 19.43,84.71 25.53,84.71 26.92,86.11 26.92,93.22 28.83,95.12 28.83,99.95 30.48,101.6 | ICSP.3 83.31,139.7 84.33,138.68 84.33,130.3 | 84.33,130.3 73.66,130.3 72.14,131.83 71.88,131.83 | 7.24,115.29 7.24,119.13 9.14,121.03 | 25.15,125.48 34.29,134.62
  Top 1.016: TR-A8.3 36.6,32.79 TR-B8.S | VR3.2 29.21,170.18 31.11,170.18 | 33.66,170.18 33.66,167.77 | 33.66,167.77 33.66,167.64 | 33.66,167.77 C4.2
  Top 1.27: TR-A7.3 30.25,44.22 30.48,44.45 TR-B7.S | PDR9.2 41.91,21.59 TR-B9.S 36.83,21.46 36.22,22 TR-A9.3 | TR-A10.3 32.16,9.93 32.38,10.16 TR-B10.S | TR-B10.S 37.47,10.16 | PDR10.2 41.27,10.16 TR-B10.S | TR-A6.3 31.75,55.65 31.75,55.88 TR-B6.S 41.91,55.88 PDR6.2 | TR-A5.3 32.16,67.08 32.38,67.31 TR-B5.S 41.91,67.31 PDR5.2 | TR-A4.3 32.16,78.51 32.38,78.74 TR-B4.S 41.91,78.74 PDR4.2 | PDR3.2 41.91,90.17 TR-B3.S 32.38,90.17 32.16,89.94 TR-A3.3 | TR-A2.3 30.89,101.37 30.48,101.6 | 30.48,101.6 TR-B2.S 41.91,101.6 PDR2.2 | TR-A1.3 34.06,112.8 34.29,113.03 TR-B1.S 41.91,113.03 PDR1.2 | 62.36,160.53 C1.2 | 26.04,114.94 25.15,114.05 25.15,114.81 25.15,124.94 | 26.04,114.94 23.77,112.65 18.03,112.65 15.39,115.29 | 26.04,114.94 29.21,114.94 30.48,113.66 30.48,113.54 30.48,101.6 | 94.11,113.53 C3.2 93.98,110.49 IN/OUT/OW.3 91.95,102.11 91.95,84.07 96.57,79.45 96.72,79.45 96.72,21.26 DC_IN.2 | BAT1.P$2 74.91,122.55 74.17,121.82 74.17,117.6 78.11,113.66 78.74,113.66 VR2.2 80.26,113.66 81.53,113.66 VR1.2 94.61,113.66 95.25,113.66 96.52,114.94 96.52,120.02 | 31.75,170.18 X5.4 | 41.27,170.18 41.91,170.18 | 33.66,170.18 41.27,170.18 | 41.91,170.18 X5.6 | 52.07,170.18 41.91,170.18 | 52.07,170.18 X5.8 | 62.23,170.18 52.07,170.18 | 62.23,170.18 62.23,173.36 62.36,173.99 | 62.36,173.99 62.23,174.62 62.23,173.86 62.36,173.99 | 62.36,173.99 X5.10 | 62.36,173.99 62.36,170.31 62.23,170.18 | 71.12,168.53 82.3,168.53 83.06,169.29 83.06,174.09 | 71.12,168.53 63.88,168.53 62.23,170.18 | 71.12,168.53 1.2 | 41.27,170.18 VR4.2 | 62.23,170.18 33.66,170.18 | 33.66,170.18 31.75,170.18 | 31.75,170.18 31.11,170.18 21.59,170.18 X5.2
  Top 1.27: 30.48,101.6 30.8,101.92 | 83.06,174.09 100UF1.- | 83.06,174.09 84.05,174.32 | 83.06,174.09 83.82,174.5 86.23,176.91 87.5,176.91 TC.1
  Top 1.778: TR-B8.S 41.91,33.02 | TR-B7.S 41.91,44.45
  Bottom 0.254: 22.23,70.48 22.48,57.79
  Bottom 0.406: 58.42,140.97 58.67,140.89
  Bottom 0.61: 50.16,127.63 U$4.4 49.97,127.58 49.78,127.76 | 36.83,114.94 37.34,115.44 37.47,115.06 | 330.2 79.5,113.16 80.01,113.66 | v34.29,133.99 34.29,136.53 arc-90 34.31,136.55 34.39,136.55 | U$2.2 80.64,175.26 80.7,175.32 | 74.55,140.97 74.68,140.97 75.95,139.7 ICSP.3 | v17.78,82.55 29.46,82.55 32,80.01 | v18.41,62.23 18.41,63.12 19.81,64.52 26.16,64.52 30.73,69.09 30.73,68.58 | v18.41,50.8 21.59,50.8 23.11,52.32 26.16,52.32 31.75,57.91 31.75,57.79 | 27.18,34.8 27.18,35.31 25.53,33.66 v18.41,33.66 | 58.67,141 C12.2 | 58.42,140.97 56.64,142.75 49.28,142.75 | 35.56,147.45 U$18.7 | 34.41,136.55 34.41,136.6 | 42.77,144.96 U$18.4 43.56,144.91 | 44.32,144.91 44.32,146.18 U$18.3 43.43,146.18 | 44.32,147.32 43.56,147.32 43.43,147.45 U$18.2 44.32,147.45 | U$18.1 43.49,148.66 43.56,148.59 44.32,148.59
  Bottom 0.813: 74.55,140.97 58.67,141 58.42,140.97 58.29,140.97 56.52,142.75 49.28,142.75 45.72,139.19 | 34.92,114.94 36.58,115.32 36.68,115.67 39.88,118.87 39.88,133.35 45.72,139.19 | 34.39,136.55 34.41,136.55 42.77,144.96 43.56,144.91 44.32,144.91 | U$2.1 80.7,175.32 | C11.2 88.9,167.39 91.95,170.43 91.95,174.24 89.41,176.78 TC.1 86.11,175.26 U$2.2 | 58.67,140.89 C12.2 | 45.72,139.19 45.72,130.56 48.51,127.76 49.78,127.76 | 35.56,147.45 34.42,146.3 34.42,136.53 34.41,136.6 | 44.32,146.18 44.32,147.32 | 44.32,147.45 44.32,148.59
  Bottom 1.27: 36.83,11.43 TR-B10.S | 36.6,33.43 TR-B8.S 36.83,34.8 | 36.83,46.99 TR-B7.S | 36.2,57.79 TR-B6.S | 36.2,68.58 TR-B5.S | 36.83,80.01 TR-B4.S | 80.01,113.66 VR1.2 91.06,113.66 93.85,116.46 93.85,150.88 85.34,159.39 v85.09,159.39 | VR4.2 41.27,165.1 39.37,163.2 30.48,163.2 27.3,166.37 17.78,166.37 11.18,159.77 4.98,153.62 4.9,124.64 8.38,121.16 SERIAL.2 | 87.38,176.78 TC.1 87.88,176.78
  Bottom 1.778: 36.83,114.94 TR-B1.S | 36.83,23.37 TR-B9.S | 36.83,91.44 TR-B3.S | TR-B2.S 36.83,102.87
  Bottom 3.81: 36.83,11.43 22.23,11.43 22.23,23.37 | 31.11,109.22 31.11,114.94 34.92,114.94 36.83,114.94 | 22.23,91.44 22.23,80.01 | 22.23,70.48 22.23,58.67 | 22.23,80.01 22.23,70.48 | 22.23,58.67 22.23,46.99 | 22.23,46.99 22.23,34.8 | 22.23,34.8 22.23,23.37 | 22.23,23.37 36.83,23.37 | 22.23,34.8 27.18,34.8 36.83,34.8 36.7,34.67 | 22.23,46.99 36.83,46.99 | 22.23,58.67 22.48,57.79 31.75,57.79 36.2,57.79 | 22.23,70.48 22.86,68.58 30.73,68.58 36.2,68.58 | 22.23,80.01 32,80.01 36.83,80.01 | 22.23,91.44 36.83,91.44 | 31.11,109.22 31.11,106.43 21.84,97.16 22.23,91.44 | 31.11,109.22 31.11,102.87 36.83,102.87
N$1
  Top 1.27: TR-A7.2 TR-B7.D
  Bottom 1.778: TR-B7.D 40.64,41.91
  Bottom 3.81: FUSE7.P$1 41.91,41.91 40.64,41.91
N$2
  Top 1.676: TR-A9.2 34.29,19.68 34.92,19.05 TR-B9.D
  Bottom 1.676: TR-B9.D 40.64,19.05
  Bottom 3.81: FUSE9.P$1 40.81,19.22 40.64,19.05
N$3
  Top 0.254: 41.91,51.44 PDR6.1 41.91,51.69
  Top 0.61: IC1.25 64.24,139.7 61.47,136.93 61.47,119.38 61.52,119.35 55.24,113.08 55.19,113.08
  Top 1.27: TR-B6.G 41.27,50.8 | 41.27,50.8 41.91,51.44 | TR-A6.1 31.11,51.03 31.11,50.8 TR-B6.G | 55.19,113.08 55.19,112.95 55.24,53.98 52.07,50.8 41.27,50.8 | TR-B6.G 33.66,47.62 10.79,47.62 10.16,46.99 X4.6 PUR6.1
N$4
  Top 1.27: OUTPUT2.2 77.22,48.26 | 77.22,48.26 LED6.- 77.95,48.49 77.22,48.26 | PUOR6.1 83.19,53.34 82.3,53.34 77.22,48.26 | 77.22,48.26 77.98,48.26
  Bottom 1.27: 74.68,48.26 72.9,48.26 | FBD6.2 69.75,51.21 69.85,50.55 70.61,49.53 74.68,48.26 | 72.39,48.77 74.42,48.51 74.68,48.26 | FUSE6.P$2 64.34,53.52 64.52,53.34 70.61,50.04 74.68,48.26
  Bottom 1.778: 73.03,48.26 74.68,48.26 OUTPUT2.2 75.56,48.26
  Bottom 3.81: 64.59,53.52 64.14,53.34 64.52,53.34 64.77,53.34 66.8,51.31 69.85,51.31 72.39,48.77 72.9,48.26 73.03,48.26 73.09,48.2
N$5
  Top 1.27: 77.98,38.1 78.11,38.1 | OUTPUT2.4 LED7.- 77.98,38.1 | PUOR7.1 82.04,44.45 77.98,40.39 77.98,38.1
  Bottom 1.27: 68.33,39.62 68.58,39.62 70.1,38.1 | 70.1,38.1 70.36,37.85 74.68,37.85 74.68,38.1 74.93,38.35 68.83,38.35 68.07,39.12 | 68.07,39.12 68.33,38.86 FBD7.2 | 68.07,39.12 67.82,39.37 | FUSE7.P$2 66.12,42.09 70.1,38.1
  Bottom 1.778: 73.03,38.1 OUTPUT2.4
  Bottom 3.81: 73.03,38.1 70.1,38.1 69.85,38.1 68.33,39.62 65.41,42.55 64.14,42.55 64.18,42.5
N$6
  Top 1.27: TR-A6.2 31.75,53.34 TR-B6.D
  Bottom 1.778: TR-B6.D 40.64,53.34
  Bottom 3.81: FUSE6.P$1 41.91,53.34 40.64,53.34
N$7
  Top 1.27: TR-A8.2 TR-B8.D
  Bottom 1.778: TR-B8.D 40.01,30.48
  Bottom 3.81: 40.01,30.48 43.18,30.48 43.01,30.66 FUSE8.P$1
N$8
  Top 0.61: 41.91,39.37 PDR7.1 | IC1.23 64.14,137.16 62.87,135.89 62.89,124.66 62.89,118.36 61.54,117.02 61.54,117.04 59,114.5 59,112.95
  Top 1.27: TR-A7.1 31.11,39.37 31.37,39.37 | 31.37,39.37 31.75,39.37 | 59,112.95 59.05,43.18 55.24,39.37 41.91,39.37 | 31.37,39.37 30.73,38.74 14.1,38.74 10.92,41.91 X4.7 PUR7.1 | 31.37,39.37 33.66,39.37
  Top 1.778: 31.75,39.37 33.66,39.37 TR-B7.G 41.91,39.37
N$9
  Top 1.27: OUTPUT2.10 77.72,7.62 | PUOR10.1 82.04,14.48 78.23,10.67 78.23,8.13 77.72,7.62 | 77.72,7.62 LED10.-
  Bottom 0.406: 64.14,7.62 64.18,7.66
  Bottom 1.27: FBD10.2 74.83,7.46 74.68,7.62 | 64.52,7.62 64.52,7.87 64.44,7.79 FUSE10.P$2
  Bottom 1.778: 73.03,7.62 74.68,7.62 OUTPUT2.10
  Bottom 3.81: 64.14,7.62 64.52,7.62 73.03,7.62
N$10
  Top 1.27: 77.72,27.94 OUTPUT2.6 74.3,27.94 | PUOR8.1 81.79,34.29 78.23,30.73 78.23,28.45 77.72,27.94 | 77.72,27.94 LED8.-
  Bottom 1.27: 67.31,27.94 67.31,27.69 67.56,27.69 67.66,27.59 FBD8.2 | FUSE8.P$2 64.34,30.66
  Bottom 1.778: 73.03,27.94 OUTPUT2.6 75.56,27.94
  Bottom 3.81: 67.31,27.94 73.03,27.94 | 64.34,30.66 67.31,27.69
N$11
  Top 0.61: IC1.16 67.18,128.27 70.48,124.97 70.48,122.55 | 3.56,23.37 3.99,23.11 | PUR9.1 X4.9
  Top 0.813: 70.48,5.08 68.45,3.05 23.62,3.05 21.59,5.08 | 3.81,23.24 3.68,23.24 3.56,23.37 3.56,31.75 PUR9.1
  Top 1.27: TR-A9.1 31.52,17.37 32.38,16.51 36.2,16.51 | 70.48,5.08 70.48,122.55 | 21.59,13.95 21.59,5.08 | 21.59,13.95 24.13,13.97 33.66,13.97 36.2,16.51 | 36.2,16.51 TR-B9.G | PDR9.1 41.91,16.51 36.2,16.51 | 3.99,23.11 5.51,21.59 13.97,21.59 21.59,13.95 | PUR9.1 X4.9
N$12  (via drill 0.6 pad 1.42)
  Top 0.61: 41.91,27.94 PDR8.1 | 65.89,117.35 64.85,116.36 65.28,116.84 65.89,117.35 | 65.89,117.35 v65.91,117.35 | 56.9,142.24 IC1.2
  Top 0.813: v55.63,117.09 55.63,120.14 58.93,123.44 58.93,127 57.91,128.02 57.91,141.22 56.9,142.24
  Top 1.016: 63.48,114.66 63.48,114.78
  Top 1.27: TR-A8.1 31.75,27.94 34.92,27.94 | 34.92,27.94 TR-B8.G | 63.48,114.78 65.89,117.35 | 63.48,114.66 63.5,30.48 60.96,27.94 41.91,27.94 | X4.8 10.16,36.83 | X4.8 10.92,36.83 20.32,27.43 20.45,27.28 30.89,27.28 31.52,27.91 34.92,27.94 | PUR8.1 X4.8
  Top 1.778: TR-B8.G 41.91,27.94
  Bottom 0.61: v65.91,117.35 65.79,117.35 65.53,117.09 v55.63,117.09
N$13
  Top 1.27: OUTPUT2.8 LED9.- 77.95,19.53 82.55,24.13 PUOR9.1
  Bottom 1.27: FBD9.2 67.41,17.68 67.31,17.78
  Bottom 1.778: 73.03,17.78 OUTPUT2.8
  Bottom 3.81: 73.03,17.78 67.31,17.78 65.58,19.22 65.36,19.22 65.28,19.3 65.2,19.22 FUSE9.P$2
N$14
  Top 1.676: TR-A10.2 TR-B10.D | TR-B10.D
  Bottom 1.676: TR-B10.D 40.64,7.62
  Bottom 3.81: FUSE10.P$1 40.81,7.79 40.64,7.62
N$15  (via drill 0.6 pad 1.42)
  Top 0.61: 53.72,149.73 v54.1,149.35 | 60.2,147.57 60.2,121.16 v58.17,119.13 | v64.77,119.13 64.26,119.63 64.26,134.11 64.77,134.62 IC1.21
  Top 0.813: 53.72,149.73 51.56,151.89 21.59,151.89 X3.8 | v58.17,149.61 60.2,147.57
  Top 1.27: R21.2 X3.8 | R22.2 96.52,100.33 IN/OUT/OW.2
  Bottom 0.61: 57.91,149.35 v58.17,149.61 | v58.17,119.13 v64.77,119.13
  Bottom 0.813: v54.1,149.35 57.91,149.35
  Bottom 1.27: IN/OUT/OW.2 96.52,112.78 96.65,113.79 96.65,151.77 86.74,161.67 61.72,161.67 55.02,154.92 28.6,154.92 24.77,151.13 X3.8
N$16
  Top 0.254: 77.72,92.2 LED2.- | OUTPUT1.4 75.95,92.2
  Top 1.27: OUTPUT1.4 74.93,92.08 | 75.95,92.2 77.72,92.2 | LED2.- 77.83,90.58 79.25,89.15 PUOR2.1
  Bottom 1.27: FBD2.2 71.22,94.9 73.91,92.2 | 63.28,99.28 63.25,99.31 | 63.28,99.28 63.28,99.23 | FUSE2.P$2 63.33,99.23 63.28,99.28
  Bottom 1.778: 74.04,92.08 OUTPUT1.4
  Bottom 3.81: 63.33,98.6 62.87,99.06 63.28,99.23 63.5,99.31 63.5,100.08 64.01,98.55 67.82,94.74 71.37,94.74 73.91,92.2 74.04,92.08
N$17
  Top 1.27: TR-A5.2 TR-B5.D | TR-B5.D
  Bottom 1.778: TR-B5.D 40.01,64.77
  Bottom 3.81: FUSE5.P$1 42.64,64.86 42.55,64.77 40.01,64.77
N$18
  Top 1.27: OUTPUT1.10 LED5.- 77.32,61.37 77.22,61.72 77.22,62.48 79.76,65.02 PUOR5.1
  Bottom 1.27: FBD5.2 74.77,62.39 OUTPUT1.10 | FUSE5.P$2 64.09,64.94 | 64.09,64.94 65.23,64.94 | 64.09,64.94 64.01,65.02
  Bottom 1.778: 74.93,61.6 OUTPUT1.10
  Bottom 3.81: 65.23,64.94 68.58,61.6 74.93,61.6
N$19
  Top 0.61: RS232.1 21.59,109.47 26.54,104.52 26.54,95.76 24,93.22 20.19,93.22 18.29,95.12 U$1.7
N$20  (via drill 0.6 pad 1.42)
  Top 0.61: IC1.26 64.64,140.97 63.37,142.24
  Top 0.813: v68.71,153.16 63.37,147.83 63.37,142.24
  Top 1.27: TR-A5.1 32.16,62.46 32.38,62.23 TR-B5.G | TR-B5.G 41.91,62.23 PDR5.1 | TR-B5.G 33.27,62.23 33.27,61.98 28.07,56.77 16,56.77 11.3,52.1 11.28,52.07 11,52.22 11.05,51.82 X4.5 PUR5.1
  Bottom 1.27: v68.71,153.16 83.06,153.16 87.63,148.59 87.63,121.28 85.72,119.38 71.75,119.38 67.64,115.29 58.8,115.29 57.78,114.3 57.78,62.23 54.61,59.05 40.01,59.05 TR-B5.G 36.2,62.23
N$21
  Top 1.27: TR-A4.2 TR-B4.D | TR-B4.D
  Bottom 1.778: TR-B4.D 40.01,76.2
  Bottom 3.81: FUSE4.P$1 42.64,76.3 42.55,76.2 40.01,76.2
N$22
  Top 1.27: OUTPUT1.8 77.34,71.75 | PUOR4.1 81.79,76.71 76.96,71.88 77.34,71.75 | 77.34,71.75 LED4.-
  Bottom 1.27: 70.36,74.17 70.87,74.17 73.41,71.63 | 73.41,71.63 75.44,71.63 | 73.41,71.63 72.9,71.63 71.63,72.9 69.09,72.9 FBD4.2 | FUSE4.P$2 64.09,76.38 63.88,76.58
  Bottom 1.778: 73.03,71.75 OUTPUT1.8
  Bottom 3.81: 64.14,76.83 66.8,74.17 70.36,74.17 71.63,72.9 72.52,72.01 72.52,71.75 73.03,71.75 | 64.14,76.83 63.5,76.83 | 64.14,76.83 63.88,76.58 63.5,76.2 64.14,76.2 64.18,76.24
N$23
  Top 1.27: TR-A3.2 37.47,87.63 | 37.47,87.63 | 37.47,87.63 TR-B3.D
  Bottom 1.778: TR-B3.D 40.01,87.63
  Bottom 3.81: FUSE3.P$1 42.64,87.72 42.55,87.63 40.01,87.63
N$24
  Top 1.27: 74.93,81.91 OUTPUT1.6 LED3.- 78.59,81.94 78.49,82.04 78.49,83.57 79.76,84.84 PUOR3.1
  Bottom 1.27: 73.53,81.91 73.41,81.79 71.22,83.98 FBD3.2 | 64.39,87.5 64.26,87.38 64.18,87.46 FUSE3.P$2
  Bottom 1.778: 74.04,81.91 OUTPUT1.6
  Bottom 3.81: 64.18,87.67 64.14,87.63 64.14,88.27 64.01,87.88 64.39,87.5 67.56,84.33 71.12,84.33 73.53,81.91 74.04,81.91
N$25  (via drill 0.6 pad 1.42)
  Top 0.61: 52.7,129.54 IC1.12
  Top 0.813: v42.55,117.86 43.69,117.86 46.23,115.32 47.6,115.32 48.87,116.59 48.87,125.7 52.7,129.54
  Top 1.27: TR-B3.G 41.91,85.09 PDR3.1 | TR-A3.1 32.16,85.32 32.38,85.09 TR-B3.G | TR-B3.G 33.4,81.66 29.72,81.66 28.19,80.14 28.19,74.22 26.04,72.01 25.91,71.91 25.88,71.93 25.88,71.91 20.47,71.91 X4.3 PUR3.2
  Bottom 1.27: v42.55,117.86 45.09,115.32 49.28,115.32 51.44,113.16 51.44,83.19 50.16,81.91 40.64,81.91 37.47,85.09 TR-B3.G
N$26  (via drill 0.6, 0.6 pad 1.42)
  Top 0.61: TR-B1.G 36.6,108.18 | 37.85,108.2 38.23,107.95 | 41.66,108.2 41.76,108.62 41.91,109.22 PDR1.1 | 56.77,127 IC1.14
  Top 0.813: 56.77,127 57.28,126.49 v57.28,124.84 | v27.69,121.03 27.56,121.03 27.69,121.28
  Top 1.27: PDR1.1 42.12,109.22 | 36.6,108.18 TR-A1.1 | 38.23,107.95 TR-B1.G | 41.66,108.2 37.85,108.2 | v27.69,121.03 30.23,118.49 38.23,118.49 41.66,115.06 44.2,115.06 45.09,114.17 45.09,108.2 42.55,108.2 41.87,108.62 41.76,108.62 | PUR1.2 X4.1 9.53,72.39 | v42.55,129.54 31.75,129.54 v31.24,129.03 27.69,125.48 27.69,121.28
  Bottom 0.61: 74.23,172.66 U$2.5 | 29.16,142.8 28.75,144.5
  Bottom 0.813: X4.1 11.25,72.72 11.25,101.88 12.7,103.33 22.53,103.33 22.61,103.4 27.64,108.46 v27.69,121.03 | 29.16,144.2 R24.2 | 74.23,172.66 66.04,164.47 60.07,164.47 52.58,156.97 27.05,156.97 23.5,153.67 18.67,153.67 17.4,152.4 17.42,149.66 18.41,148.59 24.71,148.59 28.75,144.5
  Bottom 1.27: 29.16,144.2 29.16,142.8 29.16,131.17 v31.24,129.03 | v42.55,129.54 49.78,122.3 55.63,122.3 57.28,123.95 v57.28,124.84
N$27
  Top 1.27: TR-A2.2 37.47,99.06 TR-B2.D
  Bottom 1.27: FUSE2.P$1 41.45,99.23 41.27,99.06
  Bottom 1.778: TR-B2.D 40.01,99.06
  Bottom 3.81: 40.01,99.06 41.27,99.06 41.91,99.06 42.55,99.69
N$28
  Top 0.61: 53.85,128.27 IC1.13 | 51.44,118.11 51.31,118.36
  Top 0.813: 53.85,128.27 50.42,124.84 50.42,119.25 51.31,118.36
  Top 1.27: TR-A2.1 30.89,96.75 31.11,96.52 TR-B2.G | PDR2.1 41.91,97.16 42.23,96.84 | TR-B2.G 41.91,96.52 42.23,96.84 | 51.44,118.11 51.44,99.69 48.26,96.52 42.55,96.52 42.23,96.84 | TR-B2.G 33.66,93.34 30.86,93.34 28.96,91.44 28.96,85.6 X4.2 PUR2.2
N$29
  Top 1.27: TR-A1.2 TR-B1.D | TR-B1.D
  Bottom 1.778: TR-B1.D 40.01,110.49
  Bottom 3.81: FUSE1.P$1 42.64,110.58 41.91,111.12 42.55,110.49 40.01,110.49
N$30
  Top 0.254: 78.49,102.36 LED1.- | OUTPUT1.2 75.95,102.36
  Top 1.27: 75.95,102.36 78.49,102.36 | PUOR1.1 81.28,97.54 78.74,100.08 78.74,102.11 78.61,102.23 LED1.-
  Bottom 0.61: 63.96,110.66 72.52,102.11 75.69,102.11 72.14,105.66 67.56,105.66 64.26,108.97 64.26,110.58 FUSE1.P$2
  Bottom 1.27: FBD1.2 69.09,105.92 69.34,105.66 70.36,105.66
  Bottom 1.778: 74.3,102.23 OUTPUT1.2
  Bottom 3.81: 63.96,110.66 63.96,108.76 67.06,105.66 67.56,105.66 70.36,105.66 73.79,102.23 74.3,102.23
N$31
  Top 0.61: 69.34,143.51 IC1.28
  Top 0.813: 69.34,143.51 75.69,137.16 ICSP.4 R12.2
  Bottom 0.61: 60.45,147.07 79.76,147.07 80.77,146.05 80.77,138.18 79.76,137.16 ICSP.4
  Bottom 0.813: X3.2 24.38,124.08 27.71,124.08 29.74,122.07 35.56,122.05 36.83,123.29 38.1,124.56 38.1,133.86 48.51,144.27 57.66,144.27 60.45,147.07
N$32  (via drill 0.6 pad 1.42)
  Top 0.61: 51.44,130.81 IC1.11 | X4.4 9.53,57.15
  Top 0.813: v46.99,117.47 46.99,126.36 51.44,130.81
  Top 1.27: TR-A4.1 32.16,73.89 32.38,73.66 TR-B4.G | TR-B4.G 41.91,73.66 PDR4.1 | 9.53,57.15 11.76,57.15 13.79,59.18 25.15,59.18 27.94,61.98 27.94,69.72 28.07,69.98 31.75,73.66 TR-B4.G | PUR4.2 X4.4
  Bottom 1.27: v46.99,117.47 52.07,117.47 54.61,114.94 54.61,73.66 51.44,70.48 40.01,70.48 TR-B4.G
N$33
  Top 0.61: 33.02,135.89 IC1.7
  Top 0.813: 22.86,125.73 21.34,125.86 21.72,125.98 22.86,125.73 | 22.86,125.73 33.02,135.89 | X3.3 22.86,125.73
  Top 1.27: X3.3 R16.2 15.67,119.56 14.61,118.49 SERIAL.1
N$34
  Top 0.813: R11.2 65.79,155.19 73.15,155.19 75.95,152.4 75.95,146.3 ICSP.1
N$35
  Top 0.61: 50.16,132.08 IC1.10
  Top 0.813: Q21.2 41.53,123.57 41.4,123.32 50.16,132.08
N$36
  Top 0.813: R15.2 78.74,155.58 76.96,157.35 56.77,157.35 56.78,156.48 D1.1 56.78,159.65 57.78,160.66 C1.1 59.69,161.29
N$37
  Top 0.61: IC1.1 55.88,143.51 55.88,144.78
  Top 0.813: D1.3 | 55.88,144.78 D1.3 | R11.1 60.33,154.31 60.33,154.3 D1.3
N$38
  Top 0.61: 82.8,142.24 R14.2
  Top 0.813: ICSP.2 82.8,142.24
N$39
  Top 0.61: 48.9,133.35 IC1.9
  Top 0.813: 33.66,123.19 36.2,125.73 41.27,125.73 48.9,133.35
  Top 1.27: Q21.1 33.66,123.19
N$40
  Top 0.61: 65.79,142.24 IC1.27 68.07,142.24
  Top 0.813: R13.2 ICSP.5 75.69,134.62 68.07,142.24
  Bottom 0.61: 57.53,146.3 57.53,146.18 57.4,146.3 57.66,146.3 | 59.69,148.59 80.26,148.59 82.55,146.3 82.55,137.16 80.01,134.62 ICSP.5
  Bottom 0.813: X3.1 17.91,115.52 17.12,116.36 17.09,127.61 17.78,128.27 26.42,128.27 30.63,124.03 34.27,124.03 36.35,126.11 36.35,134.62 47.5,145.8 57.02,145.8 57.53,146.3 | 57.4,146.3 59.69,148.59
N$41
  Top 0.61: 31.75,137.16 IC1.6
  Top 0.813: 31.75,137.16 25.4,130.81 X3.4
  Top 1.27: R17.2 X3.4
N$42  (via drill 0.6 pad 1.42)
  Top 0.61: 68.83,134.62 v68.83,134.87 67.82,135.89 IC1.22 | 48.54,139.9 v49.02,139.95
  Top 0.813: v36.32,143.38 38.73,140.97 47.5,140.97 48.54,139.9
  Bottom 0.61: 68.58,134.87 v68.83,134.87 | 51.82,130.81 51.77,130.81 51.41,131.17 51.41,132.69 51.44,132.72 U$4.6 | 51.82,130.81 64.52,130.81 | 36.58,146.18 U$18.6 | v36.32,143.38 35.94,143.89 | 49.02,130.81 51.82,130.81
  Bottom 0.813: 64.52,130.81 68.58,134.87 | 36.58,146.18 35.94,145.54 35.94,143.89 | v49.02,139.95 47.5,138.43 47.5,132.33 49.02,130.81
N$43  (via drill 0.6 pad 1.42)
  Top 0.61: IC1.4 53.72,139.7 50.93,142.49 | v16.64,105.16 17.02,105.16 18.29,103.89 U$1.10 18.29,101.6
  Top 0.813: X3.6 27.18,147.07 28.98,148.87 50.27,148.87 50.8,148.34 50.8,142.62 50.93,142.49
  Top 1.27: X3.6 R19.2
  Bottom 0.61: 16.51,105.03 v16.64,105.16
  Bottom 0.813: X3.6 12.7,132.72 12.7,116.46 8.51,112.27 8.51,108.08 11.56,105.03 16.51,105.03
N$44  (via drill 0.6 pad 1.42)
  Top 0.61: 51.05,150.37 52.32,149.1 52.32,142.75 54.1,140.97 IC1.3 | v19.18,105.79 19.18,105.66 19.56,105.28 U$1.9
  Top 0.813: X3.7 25.27,150.37 51.05,150.37
  Top 1.27: X3.7 R20.2
  Bottom 0.813: X3.7 24.77,146.05 26.16,144.65 26.16,133.73 25.15,132.72 17.78,132.72 14.68,129.62 14.68,115.27 11.05,111.61 11.05,108.08 12.32,106.81 18.16,106.81 v19.18,105.79
N$45
  Top 0.61: RS232.2 18.41,108.97 22.1,105.28 22.1,97.03 21.46,96.39 19.81,96.39 U$1.8
N$46
  Bottom 0.61: 82.04,173.99 U$2.3
  Bottom 0.813: 82.04,173.99 84.33,171.7 TC.2
N$47  (via drill 0.6 pad 1.42)
  Top 0.406: 82.3,124.97 R4.2
  Top 0.61: 68.07,129.54 IC1.17 | U$1.12 15.75,100.33 15.11,99.69 6.99,99.69 4.32,102.36 4.32,132.84 v7.37,136.02
  Top 0.813: 68.07,129.54 72.64,124.97 82.3,124.97 86.23,124.97 95.25,133.99 95.25,157.48 86.36,166.37 52.07,166.37 46.99,161.29 X3.10
  Bottom 0.61: v7.37,136.02 7.75,136.02 | X3.10 20.95,161.16 20.83,161.04
  Bottom 0.813: 7.75,136.02 13.59,141.83 13.59,155.85 18.72,161.01 20.83,161.04
N$48  (via drill 1.3 pad 2.54)
  other vias: 90.17,77.47
N$49
  Top 0.61: U$1.14 13.21,105.66 11.05,107.82 11.05,111.12 12.06,112.14 14.22,112.14 15.88,110.36 RS232.3
N$50  (via drill 1.3 pad 2.54)
  other vias: 90.17,63.5
N$52
  Top 1.27: 86.87,10.92 86.92,10.87 LEDR10.2 86.87,10.79 86.87,10.67 | 86.87,10.67 85.6,9.4 85.6,6.1 86.36,5.33 SOURCE.2 | 86.87,20.32 LEDR9.2 86.87,20.07 | LEDR8.2 86.66,30.68 86.87,30.48 86.87,30.73 | 86.87,40.64 86.92,40.59 | 86.87,40.64 LEDR7.2 | 86.79,68.4 86.87,68.58 | 86.79,68.4 LEDR4.2 | 86.87,14.48 PUOR10.2 | 86.87,10.67 86.87,10.92 | 86.87,10.92 86.87,14.48 | LEDR1.2 86.87,100.96 86.87,97.28 | 86.87,14.48 86.87,20.07 | 86.87,20.07 86.87,23.88 | 86.87,23.88 86.87,30.73 | 86.87,30.73 86.87,34.29 | 86.87,34.29 86.87,40.64 | 86.87,40.64 86.87,44.45 | 86.87,44.45 86.87,50.29 | 86.87,50.29 86.87,53.59 | 86.87,56.64 86.87,59.44 | 86.87,59.44 86.87,65.28 | 86.87,65.28 86.87,68.4 | 86.87,79.88 86.87,84.58 | 86.87,84.58 86.87,88.9 | 86.87,93.6 86.87,97.28 | 86.87,23.88 PUOR9.2 | 86.87,34.29 PUOR8.2 | 86.87,44.45 PUOR7.2 | 86.87,50.29 LEDR6.2 | 86.87,59.44 LEDR5.2 | 86.87,68.4 86.79,68.4 | 86.87,68.4 86.87,68.58 | 86.87,68.58 86.87,76.71 | 86.87,76.71 PUOR4.2 | 86.87,79.88 LEDR3.2 | 86.87,76.71 86.87,79.88 | 86.87,84.58 PUOR3.2 | 86.87,88.9 PUOR2.2 | 86.87,93.6 LEDR2.2 | 86.87,88.9 86.87,93.6 | 86.87,65.28 PUOR5.2 | 86.87,53.59 PUOR6.2 | 86.87,53.59 86.87,56.64 | 86.87,56.64 78.23,56.64 OUTPUT2.1 | 86.61,97.28 PUOR1.2 86.87,97.28
  Bottom 1.27: 78.23,12.7 81.03,15.49 81.03,20.32 78.49,22.86 OUTPUT2.7 | 77.98,22.86 81.28,26.16 81.28,30.99 79.5,32.77 | 74.68,33.02 OUTPUT2.5 74.07,33.88 74.68,33.02 | 74.93,32.77 74.68,33.02 | OUTPUT2.1 74.68,53.34 | OUTPUT2.1 80.01,53.34 83.06,56.39 83.06,64.01 80.39,66.67 OUTPUT1.9 74.58,67.66 FBD4.1 | 78.87,66.67 82.04,69.85 82.04,74.42 79.76,76.71 | 75.69,76.71 OUTPUT1.7 | OUTPUT1.7 79.38,76.83 82.8,80.26 82.8,83.82 79.76,86.87 | 75.44,86.87 OUTPUT1.5 | OUTPUT1.5 79.38,86.99 82.8,90.42 82.8,93.98 79.5,97.28 | 75.69,97.28 OUTPUT1.3 | OUTPUT1.3 79.12,97.16 82.3,100.33 82.3,103.63 | 79.76,106.17 79.5,106.17 | 75.44,107.44 OUTPUT1.1 75.69,107.19 | 80.26,53.34 81.53,52.07 81.53,45.47 79.25,43.18 | 91.19,5.33 SOURCE.2 86.36,5.33 84.33,7.37 84.33,11.68 83.31,12.7 75.44,12.7 75.79,12.35 FBD10.1 | OUTPUT2.9 74.93,12.45 74.77,12.61 | OUTPUT2.7 74.83,22.77 | FBD9.1 75.09,12.79 75.18,12.7 | FBD8.1 69.69,22.61 74.68,22.61 OUTPUT2.7 | 74.68,33.02 69.94,33.02 FBD7.1 | FBD6.1 71.47,43.69 74.17,43.69 74.33,43.78 OUTPUT2.3 | FBD5.1 70.77,57.5 OUTPUT2.1 | FBD3.1 71.28,79.09 73.15,77.22 75.18,77.22 OUTPUT1.7 | FBD2.1 70.26,90.01 72.64,87.63 74.93,87.63 OUTPUT1.5 | 75.69,86.87 OUTPUT1.5 | FBD1.1 69.09,100.58 70.87,98.81 73.66,98.81 75.31,97.16 OUTPUT1.3
  Bottom 3.81: OUTPUT2.9 75.18,12.7 75.44,12.7 78.23,12.7 | OUTPUT2.7 77.98,22.86 | 79.5,32.77 74.93,32.77 | OUTPUT1.9 78.87,66.67 | 79.76,76.71 75.69,76.71 | 79.76,86.87 75.69,86.87 75.44,86.87 | 79.5,97.28 75.69,97.28 | 82.3,103.63 79.76,106.17 | 79.5,106.17 78.49,107.19 75.69,107.19 | OUTPUT2.1 80.26,53.34 | 79.25,43.18 OUTPUT2.3
N$53
  Bottom 0.61: U$4.2 52.7,124.97 Q22.1
N$54
  Bottom 0.61: Q22.2 55.12,124.46 53.98,125.6 U$4.1
N$55
  Bottom 0.254: LED12.- 71.12,110.49 71.37,110.24
  Bottom 0.61: 76.2,111.76 330.1
  Bottom 1.27: 71.37,110.24 72.9,111.76 76.2,111.76 76.45,112.01
N$56
  Bottom 0.61: U$4.3 51.44,129.54 66.42,129.54
  Bottom 1.27: 66.42,129.54 67.56,129.54 69.34,127.76 69.34,123.7 68.07,122.43 BAT1.P$1
N$58  (via drill 1.3 pad 2.54)
  other vias: 90.17,48.26
N$60
  Top 0.61: U$1.13 14.48,107.44 13.34,108.58 RS232.4
N$61  (via drill 1.3 pad 2.54)
  other vias: 90.17,36.2
N$62
  Top 1.016: VR3.1 31.45,165.4 31.75,164.47 33.66,164.47
  Top 1.27: VR4.1 38.73,165.74 37.47,164.47 33.66,164.47 C4.1
  Bottom 1.27: POLYFUSE1.2 87.12,2.54 13.34,2.54 12.7,3.17 12.7,16.51 6.73,22.48 6.73,75.95 8.97,78.23 8.94,102.01 2.01,108.94 2.06,154.81 16.61,169.32 36.63,169.29 38.61,167.39 38.61,166.37 VR4.1 38.73,165.74
N$63
  Top 1.27: C3.1 91.31,110.99 91.44,111.12 POLYFUSE2.2 VR1.1 80.24,111.1 VR2.1
N$64
  Top 1.27: LEDR10.1 82.17,10.79 82.07,10.64 LED10.+
N$65
  Top 1.27: LEDR9.1 82.17,20.32 82.07,20.17 LED9.+
N$66
  Top 0.254: LED11.- 68.58,175.26
  Top 1.27: 1.1 68.71,175.39 68.58,175.26
N$67
  Top 1.27: LEDR8.1 82.17,30.48 82.07,30.33 LED8.+
N$68  (via drill 0.6 pad 1.42)
  Top 0.61: IC1.24 66.85,138.43 68,138.41 v68.25,138.68
  Top 0.813: v51.05,140.21 49.02,142.24 49.02,146.81 48.51,147.32 v46.48,147.32
  Bottom 0.61: U$4.5 50.16,137.03 | 51.05,137.92 62.74,137.92 63.5,138.68 | v68.25,138.68 68.33,138.68 | 40.89,146.18 39.62,144.91 U$18.5
  Bottom 0.813: 63.5,138.68 v68.25,138.68 | 50.16,137.03 51.05,137.92 v51.05,140.21 | v46.48,147.32 46.48,148.34 44.58,150.24 41.4,150.24 40.89,149.73 40.89,146.18
N$69
  Top 1.27: LEDR7.1 82.55,40.64 82.07,40.16 LED7.+
N$70
  Top 1.27: LED6.+ 81.92,48.26 81.99,48.18 82.8,48.99 82.8,50.29 LEDR6.1
N$71
  Top 1.27: LED5.+ 81.86,59.77 82.88,59.77 LEDR5.1
N$72
  Top 1.27: LEDR4.1 82.78,68.63 81.94,68.66 LED4.+
N$73
  Top 1.27: LEDR3.1 83.31,80.14 83.31,81.79 83.08,82.02 82.7,82.02 LED3.+
N$74
  Top 1.27: LED2.+ 82.55,92.08 83.39,92.91 LEDR2.1
N$75
  Top 1.27: LED1.+ 83.29,101.62 83.31,100.84 83.31,100.96 LEDR1.1
N$76
  pour Bottom: 95.89,24.13 96.52,24.77 87.63,24.77
N$80
  Top 0.61: U$1.5 15.75,94.23 18.29,91.69 18.29,90.68 17.65,90.55 C6.2
N$81  (via drill 0.6 pad 1.42)
  Top 0.61: v13.21,92.71 U$1.3 | 12.7,82.55 12.83,82.42 C5.2
  Top 0.813: v13.59,78.61 13.59,81.41 12.83,82.42
  Bottom 0.61: v13.59,78.61 13.46,78.74
  Bottom 0.813: 13.46,78.74 13.46,92.46 v13.21,92.71
N$82
  Top 0.61: C6.1 15.36,91.57 15.37,91.57 15.37,92.84 14.48,93.73 U$1.4 14.48,95.25
N$83
  Top 0.61: C5.1 10.03,83.06 | U$1.1 10.67,94.61 10.03,93.98
  Top 0.813: 10.03,83.06 10.03,93.98
N$84
  Top 0.61: C7.1 12.06,87.63 11.56,88.27 | 11.56,93.47 11.94,93.85 U$1.2
  Top 0.813: 11.56,88.27 11.56,93.47
N$85
  Top 0.61: U$1.6 17.02,94.61 21.34,90.3 21.34,87.25 C8.2
N$86
  Top 0.61: 6.1,156.72 6.22,156.77 | 20.27,156.74 X3.9 | 69.09,130.81 IC1.18 | 3.05,99.57 4.06,98.55 15.62,98.55 17.02,99.95 U$1.11
  Top 0.813: 3.05,99.57 3.05,153.67 6.1,156.72 | 6.22,156.77 20.27,156.74 | 69.09,130.81 72.77,127.13 85.22,127.13 92.71,134.62 92.71,150.11 | 92.71,150.11 92.71,155.58 84.45,163.83 53.34,163.83 45.72,156.21 X3.9 20.32,156.21 | 92.71,150.11 R3.2
N$94
  Top 0.61: 28.96,138.43 IC1.5
  Top 0.813: 28.96,138.43 28.83,138.43 26.29,135.89 X3.5
  Top 1.27: R18.2 X3.5
  Bottom 0.61: 72.9,173.99 U$2.6
  Bottom 0.813: 72.9,173.99 65.02,166.37 57.15,166.37 49.78,158.75 19.23,158.78 15.62,155.22 15.65,146.03 18.19,143.49 23.5,143.51 24.26,142.75 24.26,136.78 23.37,135.89 X3.5
(copper drawn outside any net)
  shapes: Bottom area x3

### Text on the board
tPlace: GeneralIO Rev1 TOP | Dan Jubenville 2009 | - | + | + | -
bPlace: Dan Jubenville 2009 | GeneralIO Rev1 BOTTOM
tNames: R1 | T1 | R2 | T2 | DC 5-25V Max | 5-25V
bNames: GND | DC 5-25V Max | GND | DC 5-25V Max | GND | DC 5-25V Max | DC 5-25V Max | GND